# Altium project MAIN_BOARD.PrjPcb (part 1 of 2)
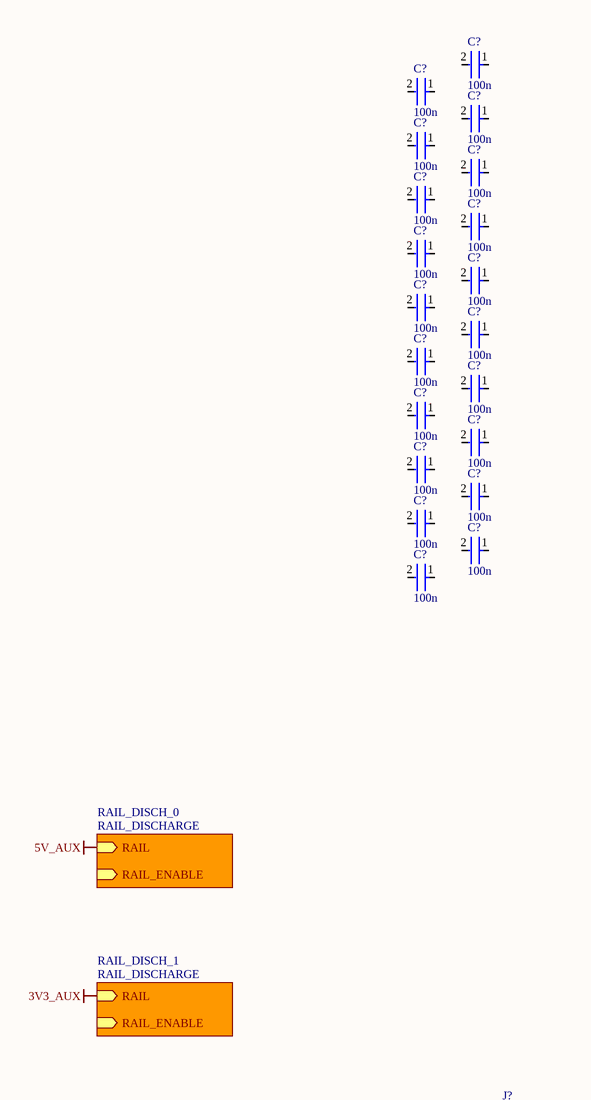
[diagram p0: MAIN_BOARD.SchDoc, top left]
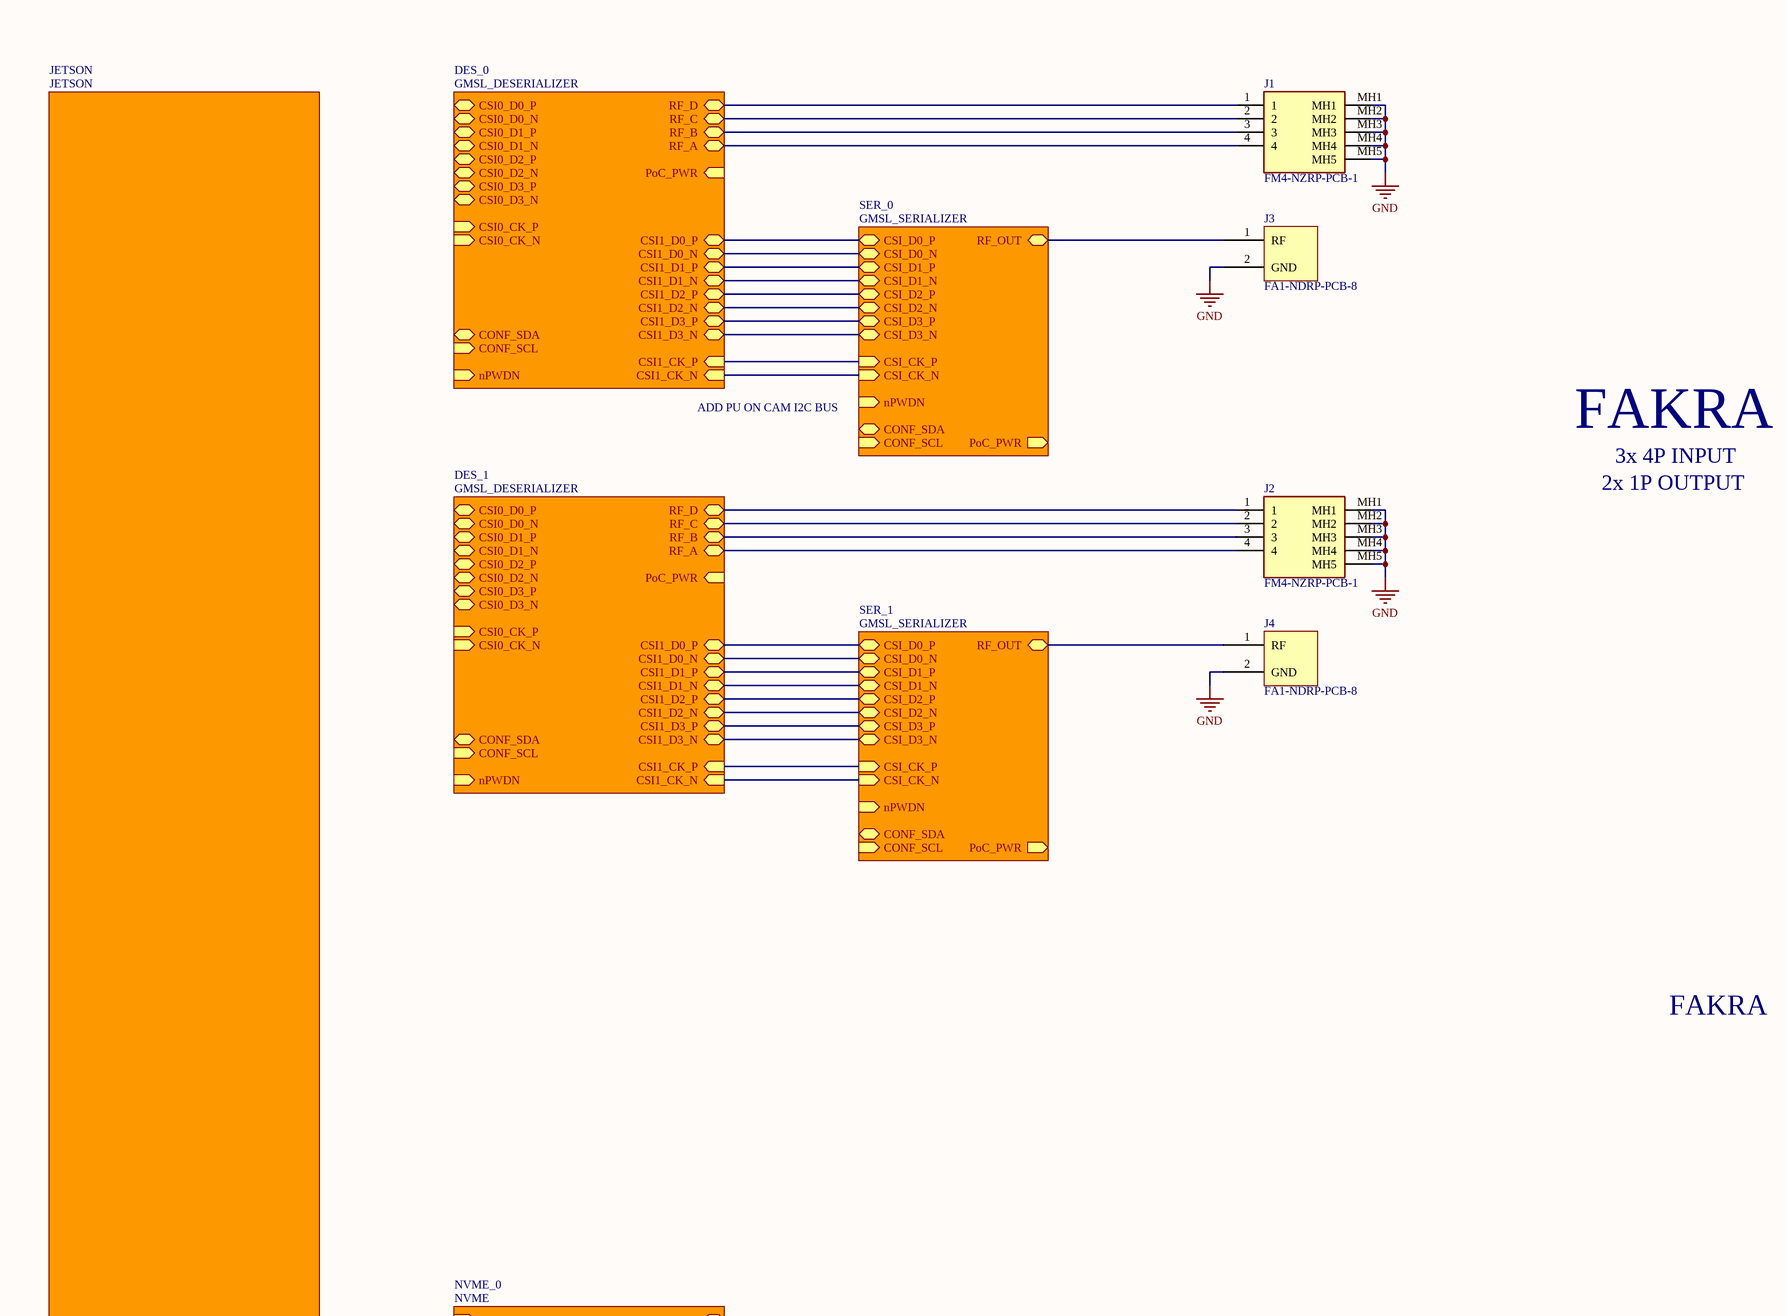
[diagram p1: MAIN_BOARD.SchDoc, top right]
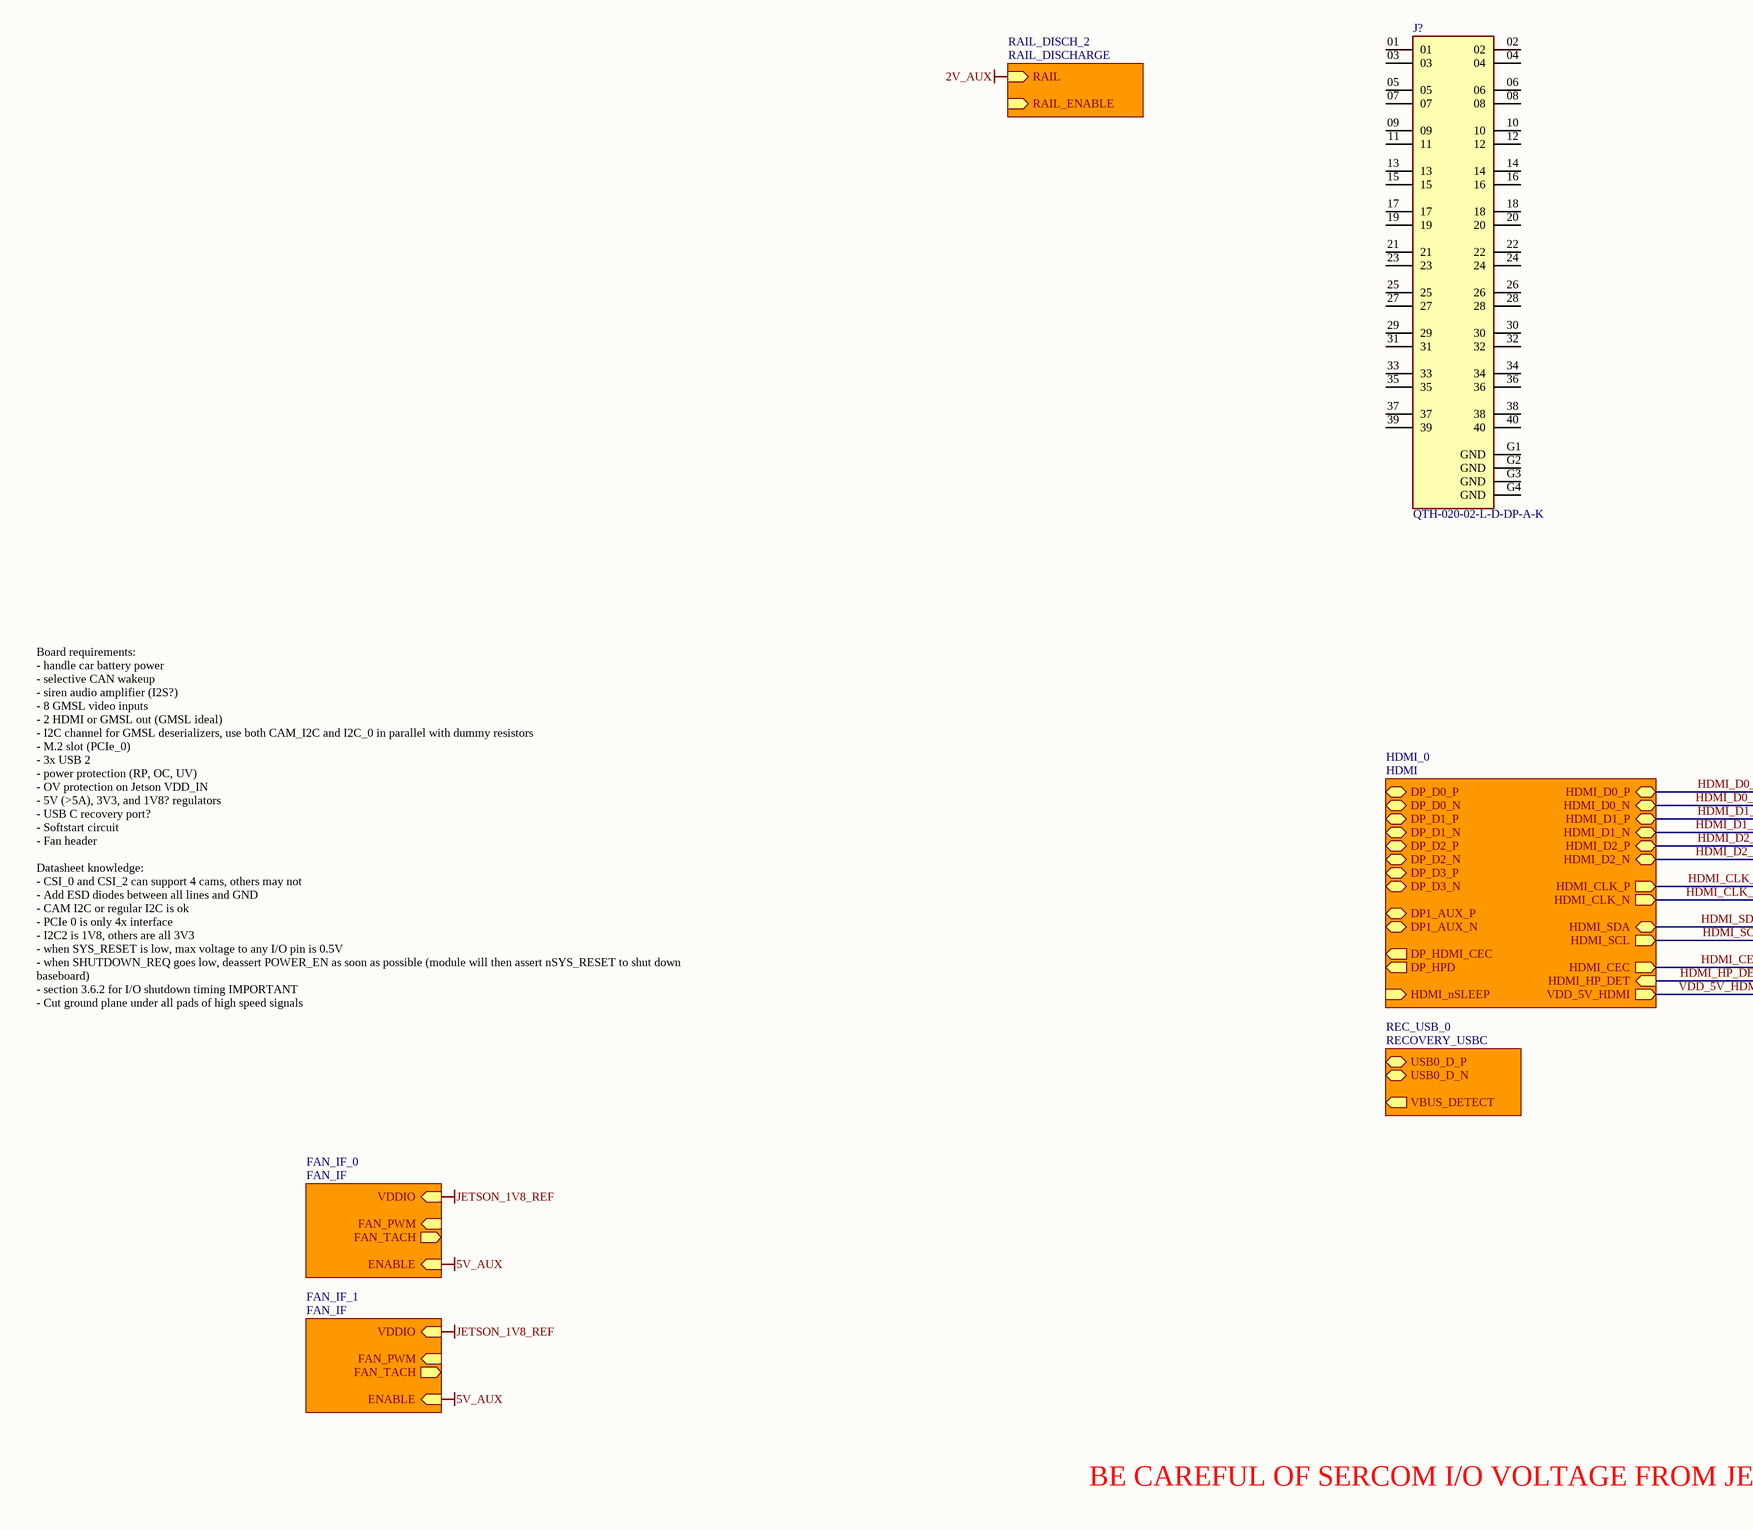
[diagram p2: MAIN_BOARD.SchDoc, bottom left]
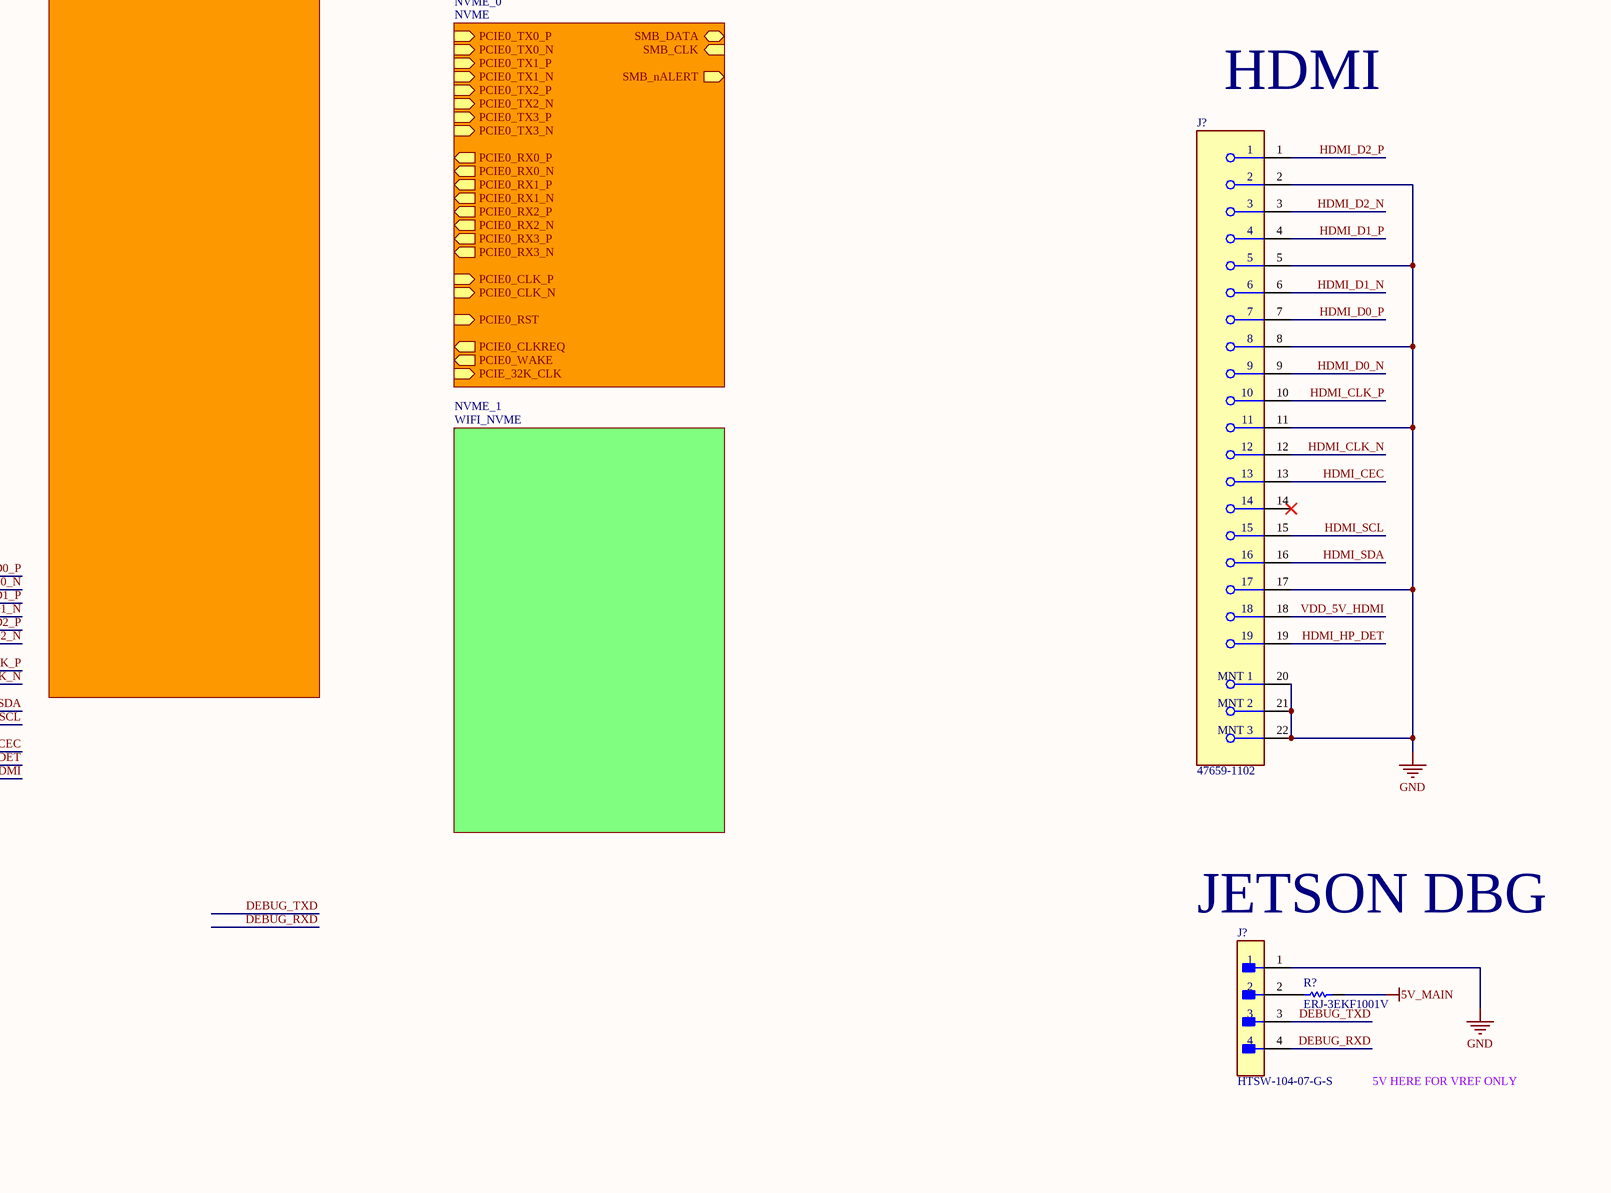
[diagram p3: MAIN_BOARD.SchDoc, bottom right]
5 sheets, 304 parts. Net scope: hierarchical (ports join the sheet entries above them; power ports are global).
Board file: ADAS_ECU_MB_revA.PcbDoc
Sheets:
  MAIN_BOARD.SchDoc
    NVME_0 = NVME.SchDoc
    HDMI_0 = HDMI.SchDoc
    REC_USB_0 = RECOVERY_USBC.SchDoc
    DES_1 = GMSL_DESERIALIZER.SchDoc
    DES_0 = GMSL_DESERIALIZER.SchDoc

## Sheet MAIN_BOARD.SchDoc
size D; SheetNumber: 1; SheetTotal: 11

### Parts
(Parts that share a designator on the sheet are numbered #1, #2 ... from top to bottom, then left to right.)
C?#1  100n  [FP-0402-L_1_0_0_05-W_0_5-IPC_A]
C?#2  100n  [FP-0402-L_1_0_0_05-W_0_5-IPC_A]
C?#3  100n  [FP-0402-L_1_0_0_05-W_0_5-IPC_A]
C?#4  100n  [FP-0402-L_1_0_0_05-W_0_5-IPC_A]
C?#5  100n  [FP-0402-L_1_0_0_05-W_0_5-IPC_A]
C?#6  100n  [FP-0402-L_1_0_0_05-W_0_5-IPC_A]
C?#7  100n  [FP-0402-L_1_0_0_05-W_0_5-IPC_A]
C?#8  100n  [FP-0402-L_1_0_0_05-W_0_5-IPC_A]
C?#9  100n  [FP-0402-L_1_0_0_05-W_0_5-IPC_A]
C?#10  100n  [FP-0402-L_1_0_0_05-W_0_5-IPC_A]
C?#11  100n  [FP-0402-L_1_0_0_05-W_0_5-IPC_A]
C?#12  100n  [FP-0402-L_1_0_0_05-W_0_5-IPC_A]
C?#13  100n  [FP-0402-L_1_0_0_05-W_0_5-IPC_A]
C?#14  100n  [FP-0402-L_1_0_0_05-W_0_5-IPC_A]
C?#15  100n  [FP-0402-L_1_0_0_05-W_0_5-IPC_A]
C?#16  100n  [FP-0402-L_1_0_0_05-W_0_5-IPC_A]
C?#17  100n  [FP-0402-L_1_0_0_05-W_0_5-IPC_A]
C?#18  100n  [FP-0402-L_1_0_0_05-W_0_5-IPC_A]
C?#19  100n  [FP-0402-L_1_0_0_05-W_0_5-IPC_A]
C?#20  100n  [FP-0402-L_1_0_0_05-W_0_5-IPC_A]
J1  FM4-NZRP-PCB-1  [FM4-NZRP-PCB-1-Footprint-1]
J2  FM4-NZRP-PCB-1  [FM4-NZRP-PCB-1-Footprint-1]
J3  FA1-NDRP-PCB-8  [FA1-NDRP-PCB-8-Footprint-1]
J4  FA1-NDRP-PCB-8  [FA1-NDRP-PCB-8-Footprint-1]
J?#1  QTH-020-02-L-D-DP-A-K  [QTH-020-02-L-D-DP-A-K-Footprint-1]
J?#2  47659-1102  [FP-47659-1102-MFG]
J?#3  HTSW-104-07-G-S  [FP-HTSW-104-07-G-S-MFG]
R?#1  ERJ-3EKF1001V  [RESC1608X55X30LL15T15]

### Sub-sheets
DES_0 = GMSL_DESERIALIZER: CSI0_D0_P (bidir), CSI0_D0_N (bidir), CSI0_D1_P (bidir), CSI0_D1_N (bidir), CSI0_D2_P (bidir), CSI0_D2_N (bidir), CSI0_D3_P (bidir), CSI0_D3_N (bidir), CSI0_CK_P (in), CSI0_CK_N (in), PoC_PWR (in), RF_B (bidir), RF_A (bidir), RF_C (bidir), RF_D (bidir), CSI1_D0_P (bidir), CSI1_D0_N (bidir), CSI1_D1_P (bidir), CSI1_D1_N (bidir), CSI1_D2_P (bidir), CSI1_D2_N (bidir), CSI1_D3_P (bidir), CSI1_D3_N (bidir), CSI1_CK_P (in), CSI1_CK_N (in), nPWDN (in), CONF_SDA (bidir), CONF_SCL (in)
DES_1 = GMSL_DESERIALIZER: CSI0_D0_P (bidir), CSI0_D0_N (bidir), CSI0_D1_P (bidir), CSI0_D1_N (bidir), CSI0_D2_P (bidir), CSI0_D2_N (bidir), CSI0_D3_P (bidir), CSI0_D3_N (bidir), CSI0_CK_P (in), CSI0_CK_N (in), PoC_PWR (in), RF_B (bidir), RF_A (bidir), RF_C (bidir), RF_D (bidir), CSI1_D0_P (bidir), CSI1_D0_N (bidir), CSI1_D1_P (bidir), CSI1_D1_N (bidir), CSI1_D2_P (bidir), CSI1_D2_N (bidir), CSI1_D3_P (bidir), CSI1_D3_N (bidir), CSI1_CK_P (in), CSI1_CK_N (in), nPWDN (in), CONF_SDA (bidir), CONF_SCL (in)
FAN_IF_0 = FAN_IF (file not in this document): FAN_PWM (in), FAN_TACH (out), VDDIO (in), ENABLE (in)
FAN_IF_1 = FAN_IF (file not in this document): FAN_PWM (in), FAN_TACH (out), VDDIO (in), ENABLE (in)
HDMI_0 = HDMI: DP_D0_P (bidir), DP_D0_N (bidir), DP_D1_P (bidir), DP_D1_N (bidir), DP_D2_P (bidir), DP_D2_N (bidir), DP_D3_P (bidir), DP_D3_N (bidir), DP1_AUX_P (bidir), DP1_AUX_N (bidir), DP_HDMI_CEC (out), DP_HPD (out), HDMI_nSLEEP (in), HDMI_D0_P (bidir), HDMI_D0_N (bidir), HDMI_D1_P (bidir), HDMI_D1_N (bidir), HDMI_D2_P (bidir), HDMI_D2_N (bidir), HDMI_CLK_P (out), HDMI_CLK_N (out), HDMI_SDA (bidir), HDMI_SCL (out), HDMI_CEC (out), HDMI_HP_DET (in), VDD_5V_HDMI (out)
JETSON = JETSON (file not in this document): no entries
NVME_0 = NVME: PCIE0_TX3_N (in), PCIE0_TX3_P (in), PCIE0_TX2_N (in), PCIE0_TX2_P (in), PCIE0_TX1_N (in), PCIE0_TX1_P (in), PCIE0_TX0_N (in), PCIE0_TX0_P (in), PCIE0_RX3_N (out), PCIE0_RX3_P (out), PCIE0_RX2_N (out), PCIE0_RX2_P (out), PCIE0_RX1_N (out), PCIE0_RX1_P (out), PCIE0_RX0_N (out), PCIE0_RX0_P (out), PCIE0_CLK_N (in), PCIE0_CLK_P (in), PCIE0_RST (in), PCIE0_CLKREQ (out), PCIE0_WAKE (out), PCIE_32K_CLK (in), SMB_DATA (bidir), SMB_CLK (in), SMB_nALERT (out)
NVME_1 = WIFI_NVME (file not in this document): no entries
RAIL_DISCH_0 = RAIL_DISCHARGE (file not in this document): RAIL (in), RAIL_ENABLE (in)
RAIL_DISCH_1 = RAIL_DISCHARGE (file not in this document): RAIL (in), RAIL_ENABLE (in)
RAIL_DISCH_2 = RAIL_DISCHARGE (file not in this document): RAIL (in), RAIL_ENABLE (in)
REC_USB_0 = RECOVERY_USBC: USB0_D_N (bidir), USB0_D_P (bidir), VBUS_DETECT (out)
SER_0 = GMSL_SERIALIZER (file not in this document): CSI_D0_P (bidir), CSI_D0_N (bidir), CSI_D1_P (bidir), CSI_D1_N (bidir), CSI_D2_P (bidir), CSI_D2_N (bidir), CSI_D3_P (bidir), CSI_D3_N (bidir), CSI_CK_P (in), CSI_CK_N (in), nPWDN (in), PoC_PWR (out), CONF_SDA (bidir), CONF_SCL (in), RF_OUT (bidir)
SER_1 = GMSL_SERIALIZER (file not in this document): CSI_D0_P (bidir), CSI_D0_N (bidir), CSI_D1_P (bidir), CSI_D1_N (bidir), CSI_D2_P (bidir), CSI_D2_N (bidir), CSI_D3_P (bidir), CSI_D3_N (bidir), CSI_CK_P (in), CSI_CK_N (in), nPWDN (in), PoC_PWR (out), CONF_SDA (bidir), CONF_SCL (in), RF_OUT (bidir)

### Nets
2V_AUX: sheet RAIL_DISCH_2/RAIL
5V_AUX: sheet FAN_IF_0/ENABLE, sheet FAN_IF_1/ENABLE, sheet RAIL_DISCH_0/RAIL
5V_MAIN: R?#1.1
GND: J1.MH1 J1.MH2 J1.MH3 J1.MH4 J1.MH5 J2.MH1 J2.MH2 J2.MH3 J2.MH4 J2.MH5 J3.2(GND) J4.2(GND) J?#2.2 J?#2.5 J?#2.8 J?#2.11 J?#2.17 J?#2.20(MNT_1) J?#2.21(MNT_2) J?#2.22(MNT_3) J?#3.1
JETSON_1V8_REF: sheet FAN_IF_0/VDDIO, sheet FAN_IF_1/VDDIO
CKB_N_DES_0: sheet SER_0/CSI_CK_N, sheet DES_0/CSI1_CK_N
CKB_N_DES_1: sheet SER_1/CSI_CK_N, sheet DES_1/CSI1_CK_N
CKB_P_DES_0: sheet SER_0/CSI_CK_P, sheet DES_0/CSI1_CK_P
CKB_P_DES_1: sheet SER_1/CSI_CK_P, sheet DES_1/CSI1_CK_P
DB0_N_DES_0: sheet SER_0/CSI_D0_N, sheet DES_0/CSI1_D0_N
DB0_N_DES_1: sheet SER_1/CSI_D0_N, sheet DES_1/CSI1_D0_N
DB0_P_DES_0: sheet SER_0/CSI_D0_P, sheet DES_0/CSI1_D0_P
DB0_P_DES_1: sheet SER_1/CSI_D0_P, sheet DES_1/CSI1_D0_P
DB1_N_DES_0: sheet SER_0/CSI_D1_N, sheet DES_0/CSI1_D1_N
DB1_N_DES_1: sheet SER_1/CSI_D1_N, sheet DES_1/CSI1_D1_N
DB1_P_DES_0: sheet SER_0/CSI_D1_P, sheet DES_0/CSI1_D1_P
DB1_P_DES_1: sheet SER_1/CSI_D1_P, sheet DES_1/CSI1_D1_P
DB2_N_DES_0: sheet SER_0/CSI_D2_N, sheet DES_0/CSI1_D2_N
DB2_N_DES_1: sheet SER_1/CSI_D2_N, sheet DES_1/CSI1_D2_N
DB2_P_DES_0: sheet SER_0/CSI_D2_P, sheet DES_0/CSI1_D2_P
DB2_P_DES_1: sheet SER_1/CSI_D2_P, sheet DES_1/CSI1_D2_P
DB3_N_DES_0: sheet SER_0/CSI_D3_N, sheet DES_0/CSI1_D3_N
DB3_N_DES_1: sheet SER_1/CSI_D3_N, sheet DES_1/CSI1_D3_N
DB3_P_DES_0: sheet SER_0/CSI_D3_P, sheet DES_0/CSI1_D3_P
DB3_P_DES_1: sheet SER_1/CSI_D3_P, sheet DES_1/CSI1_D3_P
DEBUG_RXD: J?#3.4
DEBUG_TXD: J?#3.3
HDMI_CEC: J?#2.13 ; sheet HDMI_0/HDMI_CEC
HDMI_CLK_N: J?#2.12 ; sheet HDMI_0/HDMI_CLK_N
HDMI_CLK_P: J?#2.10 ; sheet HDMI_0/HDMI_CLK_P
HDMI_D0_N: J?#2.9 ; sheet HDMI_0/HDMI_D0_N
HDMI_D0_P: J?#2.7 ; sheet HDMI_0/HDMI_D0_P
HDMI_D1_N: J?#2.6 ; sheet HDMI_0/HDMI_D1_N
HDMI_D1_P: J?#2.4 ; sheet HDMI_0/HDMI_D1_P
HDMI_D2_N: J?#2.3 ; sheet HDMI_0/HDMI_D2_N
HDMI_D2_P: J?#2.1 ; sheet HDMI_0/HDMI_D2_P
HDMI_HP_DET: J?#2.19 ; sheet HDMI_0/HDMI_HP_DET
HDMI_SCL: J?#2.15 ; sheet HDMI_0/HDMI_SCL
HDMI_SDA: J?#2.16 ; sheet HDMI_0/HDMI_SDA
PoC_A: J1.4 ; sheet DES_0/RF_A
PoC_A: J2.4 ; sheet DES_1/RF_A  [a separate net that carries the same name]
PoC_B: J1.3 ; sheet DES_0/RF_B
PoC_B: J2.3 ; sheet DES_1/RF_B  [a separate net that carries the same name]
PoC_C: J1.2 ; sheet DES_0/RF_C
PoC_C: J2.2 ; sheet DES_1/RF_C  [a separate net that carries the same name]
PoC_D: J1.1 ; sheet DES_0/RF_D
PoC_D: J2.1 ; sheet DES_1/RF_D  [a separate net that carries the same name]
VDD_5V_HDMI: J?#2.18 ; sheet HDMI_0/VDD_5V_HDMI
NetJ3_1: J3.1(RF) ; sheet SER_0/RF_OUT
NetJ4_1: J4.1(RF) ; sheet SER_1/RF_OUT
NetJ?#3_2: J?#3.2 R?#1.2

Not connected (* = marked no-connect by the designer): C?#1 1 2; C?#2 1 2; C?#3 1 2; C?#4 1 2; C?#5 1 2; C?#6 1 2; C?#7 1 2; C?#8 1 2; C?#9 1 2; C?#10 1 2; C?#11 1 2; C?#12 1 2; C?#13 1 2; C?#14 1 2; C?#15 1 2; C?#16 1 2; C?#17 1 2; C?#18 1 2; C?#19 1 2; C?#20 1 2; J?#1 01 02 03 04 05 06 07 08 09 10 11 12 13 14 15 16 17 18 19 20 21 22 23 24 25 26 27 28 29 30 31 32 33 34 35 36 37 38 39 40 G1(GND) G2(GND) G3(GND) G4(GND); J?#2 14*

### Notes on the sheet
- ADD PU ON CAM I2C BUS
- FAKRA
- 2x 1P OUTPUT
- 3x 4P INPUT
- HDMI
- Board requirements:
  - handle car battery power
  - selective CAN wakeup
  - siren audio amplifier (I2S?)
  - 8 GMSL video inputs
  - 2 HDMI or GMSL out (GMSL ideal)
  - I2C channel for GMSL deserializers, use both CAM_I2C and I2C_0 in parallel with dummy resistors
  - M.2 slot (PCIe_0)
  - 3x USB 2
  - power protection (RP, OC, UV)
  - OV protection on Jetson VDD_IN
  - 5V (>5A), 3V3, and 1V8? regulators
  - USB C recovery port?
  - Softstart circuit
  - Fan header
  Datasheet knowledge:
  - CSI_0 and CSI_2 can support 4 cams, others may not
  - Add ESD diodes between all lines and GND
  - CAM I2C or regular I2C is ok
  - PCIe 0 is only 4x interface
  - I2C2 is 1V8, others are all 3V3
  - when SYS_RESET is low, max voltage to any I/O pin is 0.5V
  - when SHUTDOWN_REQ goes low, deassert POWER_EN as soon as possible (module will then assert nSYS_RESET to shut down baseboard)
  - section 3.6.2 for I/O shutdown timing IMPORTANT
  - Cut ground plane under all pads of high speed signals
- (near J?#3) JETSON DBG
- 5V HERE FOR VREF ONLY
- BE CAREFUL OF SERCOM I/O VOLTAGE FROM JETSON

### Library data of the parts
C?#1-C?#20 = CMP-001-00058-1: LARGE PADS, 0402 CAP, CHANGE COMMENT TO MATCH REAL P/N; Capacitor Type: Ceramic; Min Operating Temperature: -55°C; Mounting Technology: Surface Mount; Pins: 2; Case/Package: 0402; RoHS Compliant: Yes; Max Operating Temperature: 85°C
J1 J2 = CMP-002-00044-4: Connector RF Mini-FAKRA Plug 9GHz 50Ohm Solder Right Angle Through Hole; Source: fakra4ch.SchLib; Component Type: Standard; Pins: 9; Design Item ID: CMP-002-00085-1
J3 J4 = CMP-002-00054-1: RF F Connector, Male, Board Mount, Solder Terminal, Plug; Connector Type: RF F CONNECTOR; RoHS Compliant: Yes; Mounting Technology: Board
J?#1 = CMP-002-00077-1: Board Stacking Connector; Connector Type: BOARD STACKING CONNECTOR; RoHS Compliant: Yes
J?#2 = CMP-04768-000010-1: HDMI REC.VERTICAL SMT TYPE W/HEI; RoHS Compliant: Yes
J?#3 = CMP-02766-001776-1: CONN HEADER VERT 4POS 2.54MM; Gender: Male; Number of Contacts: 4; Packaging: Bulk; RoHS Compliant: Yes; Number of Rows: 1; Mount: Through Hole; Contact Material: Bronze; Series: HTSW; Radiation Hardening: No; Pitch: 2.54mm; Reach SVHC Compliant: Yes; Contact Plating: Gold; Termination: Through Hole
R?#1 = CMP-2000-00180-1: Manufacturer: Panasonic; Part Number: ERJ-3EKF1001V

## Sheet NVME.SchDoc
size C; SheetNumber: 5; SheetTotal: 11
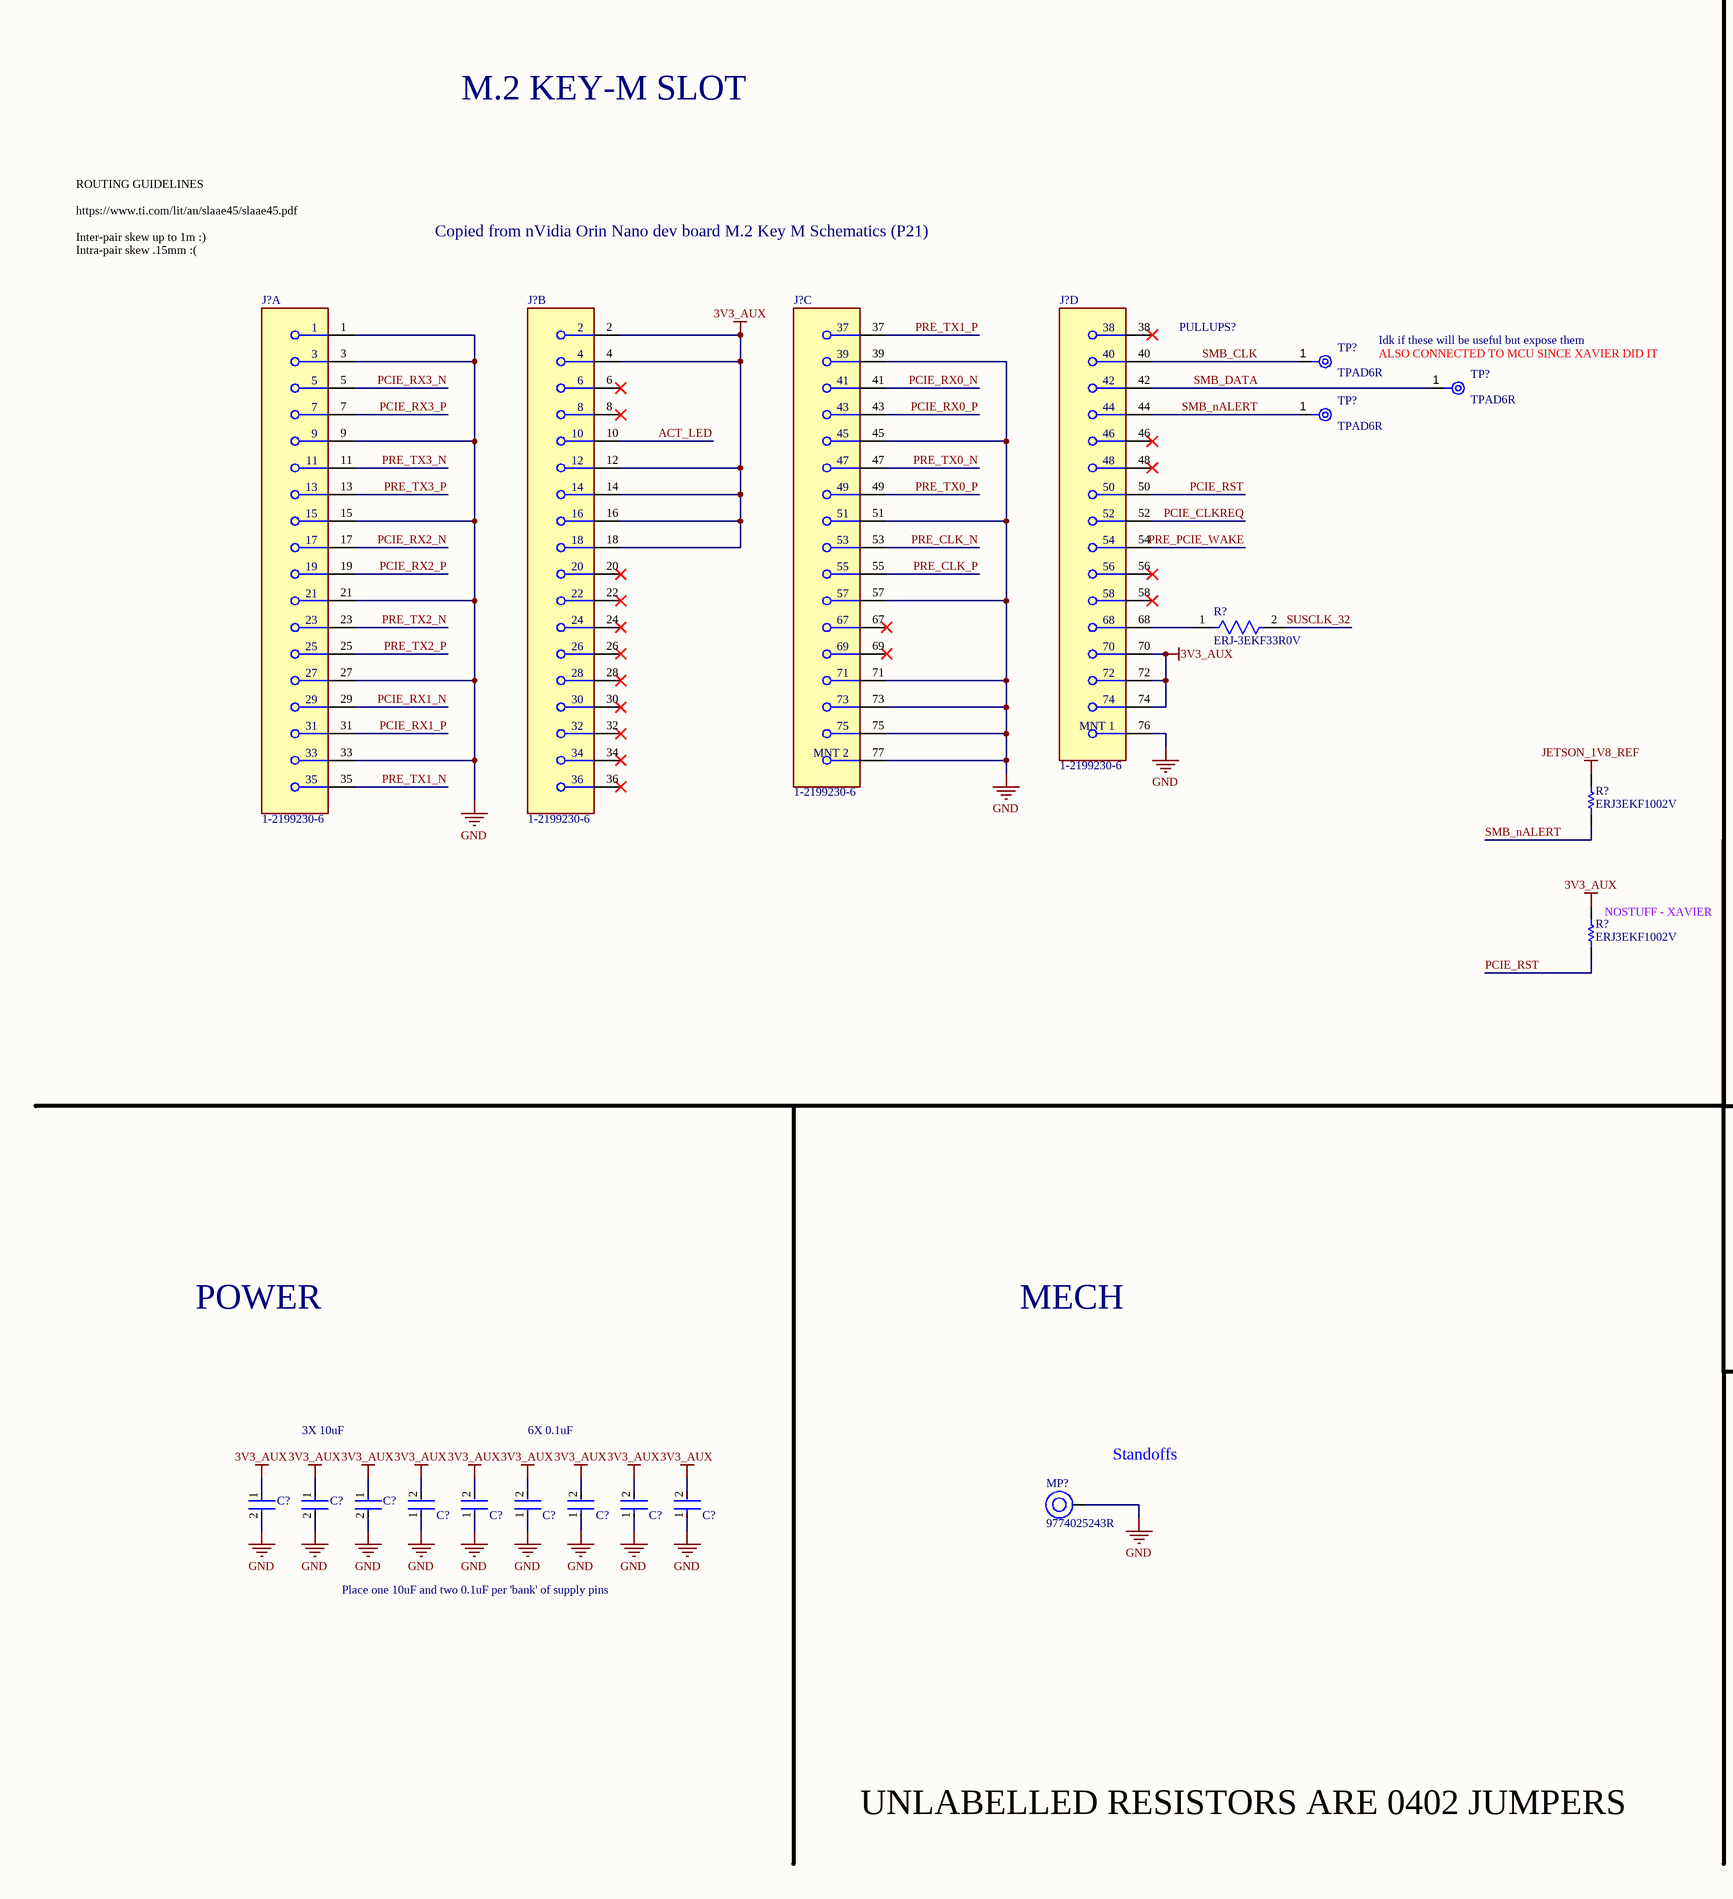
[diagram p4: NVME.SchDoc, left]
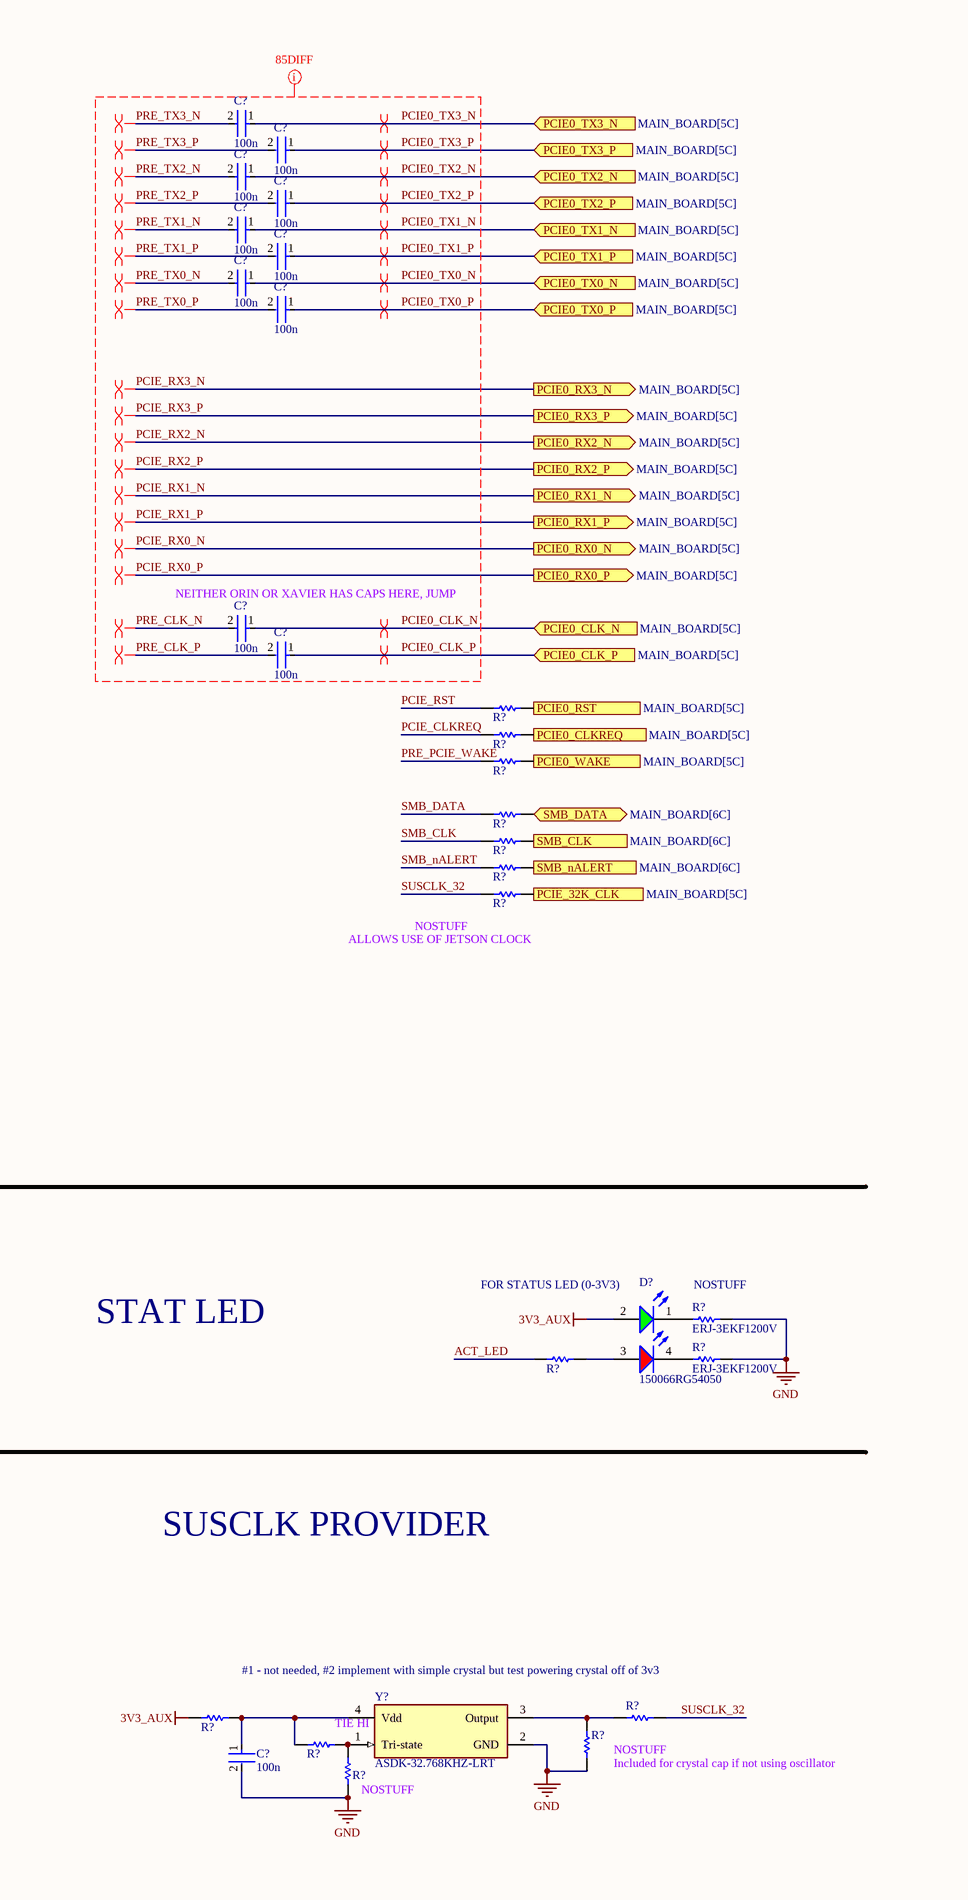
[diagram p5: NVME.SchDoc, right]

### Parts
(Parts that share a designator on the sheet are numbered #1, #2 ... from top to bottom, then left to right.)
C?#21  100n  [FP-0402-L_1_0_0_05-W_0_5-IPC_A]
C?#22  100n  [FP-0402-L_1_0_0_05-W_0_5-IPC_A]
C?#23  100n  [FP-0402-L_1_0_0_05-W_0_5-IPC_A]
C?#24  100n  [FP-0402-L_1_0_0_05-W_0_5-IPC_A]
C?#25  100n  [FP-0402-L_1_0_0_05-W_0_5-IPC_A]
C?#26  100n  [FP-0402-L_1_0_0_05-W_0_5-IPC_A]
C?#27  100n  [FP-0402-L_1_0_0_05-W_0_5-IPC_A]
C?#28  100n  [FP-0402-L_1_0_0_05-W_0_5-IPC_A]
C?#29  100n  [FP-0402-L_1_0_0_05-W_0_5-IPC_A]
C?#30  100n  [FP-0402-L_1_0_0_05-W_0_5-IPC_A]
C?#31  GRM188R60J106ME47D  [FP-GRM188-0_1-e0_2_0_55-IPC_A]  (value not drawn)
C?#32  GRM188R60J106ME47D  [FP-GRM188-0_1-e0_2_0_55-IPC_A]  (value not drawn)
C?#33  GRM188R60J106ME47D  [FP-GRM188-0_1-e0_2_0_55-IPC_A]  (value not drawn)
C?#34  C1005X7R1H104K050BB  [FP-C1005-050-0_05-IPC_C]  (value not drawn)
C?#35  C1005X7R1H104K050BB  [FP-C1005-050-0_05-IPC_C]  (value not drawn)
C?#36  C1005X7R1H104K050BB  [FP-C1005-050-0_05-IPC_C]  (value not drawn)
C?#37  C1005X7R1H104K050BB  [FP-C1005-050-0_05-IPC_C]  (value not drawn)
C?#38  C1005X7R1H104K050BB  [FP-C1005-050-0_05-IPC_C]  (value not drawn)
C?#39  C1005X7R1H104K050BB  [FP-C1005-050-0_05-IPC_C]  (value not drawn)
C?#40  100n  [FP-0402-L_1_0_0_05-W_0_5-IPC_A]
D?  150066RG54050  [WL-SBCD_0606]
J?#4  1-2199230-6  [FP-1-2199230-6-MFG]  (part A of 4)
J?#5  1-2199230-6  [FP-1-2199230-6-MFG]  (part B of 4)
J?#6  1-2199230-6  [FP-1-2199230-6-MFG]  (part C of 4)
J?#7  1-2199230-6  [FP-1-2199230-6-MFG]  (part D of 4)
MP?  9774025243R  [9774025243]
R?#2  0402 JUMPER  [RESC1005X40X25ML05T05]  (value not drawn)
R?#3  ERJ-3EKF33R0V  [FP-ERJ3EK-MFG]
R?#4  0402 JUMPER  [RESC1005X40X25ML05T05]  (value not drawn)
R?#5  0402 JUMPER  [RESC1005X40X25ML05T05]  (value not drawn)
R?#6  0402 JUMPER  [RESC1005X40X25ML05T05]  (value not drawn)
R?#7  0402 JUMPER  [RESC1005X40X25ML05T05]  (value not drawn)
R?#8  0402 JUMPER  [RESC1005X40X25ML05T05]  (value not drawn)
R?#9  0402 JUMPER  [RESC1005X40X25ML05T05]  (value not drawn)
R?#10  ERJ3EKF1002V  [RESC1609X55X30LL15T15]
R?#11  ERJ3EKF1002V  [RESC1609X55X30LL15T15]
R?#12  ERJ-3EKF1200V  [RESC1609X55X30ML15T15]
R?#13  0402 JUMPER  [RESC1005X40X25ML05T05]  (value not drawn)
R?#14  ERJ-3EKF1200V  [RESC1609X55X30ML15T15]
R?#15  0402 JUMPER  [RESC1005X40X25ML05T05]  (value not drawn)
R?#16  0402 JUMPER  [RESC1005X40X25ML05T05]  (value not drawn)
R?#17  0402 JUMPER  [RESC1005X40X25ML05T05]  (value not drawn)
R?#18  0402 JUMPER  [RESC1005X40X25ML05T05]  (value not drawn)
R?#19  0402 JUMPER  [RESC1005X40X25ML05T05]  (value not drawn)
TP?#1  TPAD6R  [New footprint 1]
TP?#2  TPAD6R  [New footprint 1]
TP?#3  TPAD6R  [New footprint 1]
Y?  ASDK-32.768KHZ-LRT  [FP-ASDK-MFG]

### Ports
PCIE0_CLK_N (in, see MAIN_BOARD[5C]), PCIE0_CLK_P (in, see MAIN_BOARD[5C]), PCIE0_CLKREQ (out, see MAIN_BOARD[5C]), PCIE0_RST (in, see MAIN_BOARD[5C]), PCIE0_RX0_N (out, see MAIN_BOARD[5C]), PCIE0_RX0_P (out, see MAIN_BOARD[5C]), PCIE0_RX1_N (out, see MAIN_BOARD[5C]), PCIE0_RX1_P (out, see MAIN_BOARD[5C]), PCIE0_RX2_N (out, see MAIN_BOARD[5C]), PCIE0_RX2_P (out, see MAIN_BOARD[5C]), PCIE0_RX3_N (out, see MAIN_BOARD[5C]), PCIE0_RX3_P (out, see MAIN_BOARD[5C]), PCIE0_TX0_N (in, see MAIN_BOARD[5C]), PCIE0_TX0_P (in, see MAIN_BOARD[5C]), PCIE0_TX1_N (in, see MAIN_BOARD[5C]), PCIE0_TX1_P (in, see MAIN_BOARD[5C]), PCIE0_TX2_N (in, see MAIN_BOARD[5C]), PCIE0_TX2_P (in, see MAIN_BOARD[5C]), PCIE0_TX3_N (in, see MAIN_BOARD[5C]), PCIE0_TX3_P (in, see MAIN_BOARD[5C]), PCIE0_WAKE (out, see MAIN_BOARD[5C]), PCIE_32K_CLK (in, see MAIN_BOARD[5C]), SMB_CLK (in, see MAIN_BOARD[6C]), SMB_DATA (bidir, see MAIN_BOARD[6C]), SMB_nALERT (out, see MAIN_BOARD[6C])

### Nets
3V3_AUX: C?#31.1 C?#32.1 C?#33.1 C?#34.2 C?#35.2 C?#36.2 C?#37.2 C?#38.2 C?#39.2 D?.2(A) J?#5.2 J?#5.4 J?#5.12 J?#5.14 J?#5.16 J?#5.18 J?#7.70 J?#7.72 J?#7.74 R?#11.2 R?#15.1
GND: C?#31.2 C?#32.2 C?#33.2 C?#34.1 C?#35.1 C?#36.1 C?#37.1 C?#38.1 C?#39.1 C?#40.2 J?#4.1 J?#4.3 J?#4.9 J?#4.15 J?#4.21 J?#4.27 J?#4.33 J?#6.39 J?#6.45 J?#6.51 J?#6.57 J?#6.71 J?#6.73 J?#6.75 J?#6.77(MNT_2) J?#7.76(MNT_1) MP?.1 R?#12.1 R?#14.1 R?#18.1 R?#19.1 Y?.2(GND)
JETSON_1V8_REF: R?#10.2
ACT_LED: J?#5.10 R?#13.1
PCIE0_CLK_N: C?#29.1 ; port PCIE0_CLK_N
PCIE0_CLK_P: C?#30.1 ; port PCIE0_CLK_P
PCIE0_TX0_N: C?#27.1 ; port PCIE0_TX0_N
PCIE0_TX0_P: C?#28.1 ; port PCIE0_TX0_P
PCIE0_TX1_N: C?#25.1 ; port PCIE0_TX1_N
PCIE0_TX1_P: C?#26.1 ; port PCIE0_TX1_P
PCIE0_TX2_N: C?#23.1 ; port PCIE0_TX2_N
PCIE0_TX2_P: C?#24.1 ; port PCIE0_TX2_P
PCIE0_TX3_N: C?#21.1 ; port PCIE0_TX3_N
PCIE0_TX3_P: C?#22.1 ; port PCIE0_TX3_P
PCIE_CLKREQ: J?#7.52 R?#4.1
PCIE_RST: J?#7.50 R?#2.1 R?#11.1
PCIE_RX0_N: J?#6.41 ; port PCIE0_RX0_N
PCIE_RX0_P: J?#6.43 ; port PCIE0_RX0_P
PCIE_RX1_N: J?#4.29 ; port PCIE0_RX1_N
PCIE_RX1_P: J?#4.31 ; port PCIE0_RX1_P
PCIE_RX2_N: J?#4.17 ; port PCIE0_RX2_N
PCIE_RX2_P: J?#4.19 ; port PCIE0_RX2_P
PCIE_RX3_N: J?#4.5 ; port PCIE0_RX3_N
PCIE_RX3_P: J?#4.7 ; port PCIE0_RX3_P
PRE_CLK_N: C?#29.2 J?#6.53
PRE_CLK_P: C?#30.2 J?#6.55
PRE_PCIE_WAKE: J?#7.54 R?#5.1
PRE_TX0_N: C?#27.2 J?#6.47
PRE_TX0_P: C?#28.2 J?#6.49
PRE_TX1_N: C?#25.2 J?#4.35
PRE_TX1_P: C?#26.2 J?#6.37
PRE_TX2_N: C?#23.2 J?#4.23
PRE_TX2_P: C?#24.2 J?#4.25
PRE_TX3_N: C?#21.2 J?#4.11
PRE_TX3_P: C?#22.2 J?#4.13
SMB_CLK: J?#7.40 R?#7.1 TP?#1.1(TP)
SMB_DATA: J?#7.42 R?#6.1 TP?#2.1(TP)
SMB_nALERT: J?#7.44 R?#8.1 R?#10.1 TP?#3.1(TP)
SUSCLK_32: R?#3.2 R?#9.1 R?#17.1
NetC?#40_1: C?#40.1 R?#15.2 R?#16.1 Y?.4(Vdd)
NetD?_1: D?.1(K) R?#12.2
NetD?_3: D?.3(A) R?#13.2
NetD?_4: D?.4(K) R?#14.2
NetJ?#7_68: J?#7.68 R?#3.1
NetR?#2_2: R?#2.2 ; port PCIE0_RST
NetR?#4_2: R?#4.2 ; port PCIE0_CLKREQ
NetR?#5_2: R?#5.2 ; port PCIE0_WAKE
NetR?#6_2: R?#6.2 ; port SMB_DATA
NetR?#7_2: R?#7.2 ; port SMB_CLK
NetR?#8_2: R?#8.2 ; port SMB_nALERT
NetR?#9_2: R?#9.2 ; port PCIE_32K_CLK
NetR?#16_2: R?#16.2 R?#19.2 Y?.1(Tri-state)
NetR?#17_2: R?#17.2 R?#18.2 Y?.3(Output)

Not connected (* = marked no-connect by the designer): J?#5 6* 8* 20* 22* 24* 26* 28* 30* 32* 34* 36*; J?#6 67* 69*; J?#7 38* 46* 48* 56* 58*

### Layout directives
differential pair; differential pair class 85DIFF: PCIE0_CLK_N, PCIE0_CLK_P, PCIE0_TX0_N, PCIE0_TX0_P, PCIE0_TX1_N, PCIE0_TX1_P, PCIE0_TX2_N, PCIE0_TX2_P, PCIE0_TX3_N, PCIE0_TX3_P, PCIE_RX0_N, PCIE_RX0_P, PCIE_RX1_N, PCIE_RX1_P, PCIE_RX2_N, PCIE_RX2_P, PCIE_RX3_N, PCIE_RX3_P, PRE_CLK_N, PRE_CLK_P, PRE_TX0_N, PRE_TX0_P, PRE_TX1_N, PRE_TX1_P, PRE_TX2_N, PRE_TX2_P, PRE_TX3_N, PRE_TX3_P
net class 85DIFF: PCIE0_CLK_N, PCIE0_CLK_P, PCIE0_TX0_N, PCIE0_TX0_P, PCIE0_TX1_N, PCIE0_TX1_P, PCIE0_TX2_N, PCIE0_TX2_P, PCIE0_TX3_N, PCIE0_TX3_P, PCIE_RX0_N, PCIE_RX0_P, PCIE_RX1_N, PCIE_RX1_P, PCIE_RX2_N, PCIE_RX2_P, PCIE_RX3_N, PCIE_RX3_P, PRE_CLK_N, PRE_CLK_P, PRE_TX0_N, PRE_TX0_P, PRE_TX1_N, PRE_TX1_P, PRE_TX2_N, PRE_TX2_P, PRE_TX3_N, PRE_TX3_P

### Notes on the sheet
- M.2 KEY-M SLOT
- ROUTING GUIDELINES
  https://www.ti.com/lit/an/slaae45/slaae45.pdf
  Inter-pair skew up to 1m :)
  Intra-pair skew .15mm :(
- Copied from nVidia Orin Nano dev board M.2 Key M Schematics (P21)
- PULLUPS?
- (near TP?#2) Idk if these will be useful but expose them
- (near TP?#2) ALSO CONNECTED TO MCU SINCE XAVIER DID IT
- (near C?#29) NEITHER ORIN OR XAVIER HAS CAPS HERE, JUMP
- (near R?#9) ALLOWS USE OF JETSON CLOCK
- (near R?#9) NOSTUFF
- (near R?#11) NOSTUFF - XAVIER
- STAT LED
- (near D?) FOR STATUS LED (0-3V3)
- (near R?#12) NOSTUFF
- POWER
- MECH
- 3X 10uF
- 6X 0.1uF
- Standoffs
- SUSCLK PROVIDER
- Place one 10uF and two 0.1uF per 'bank' of supply pins
- #1 - not needed, #2 implement with simple crystal but test powering crystal off of 3v3
- (near Y?) TIE HI
- (near R?#19) NOSTUFF
- (near R?#18) NOSTUFF
- (near R?#18) Included for crystal cap if not using oscillator
- UNLABELLED RESISTORS ARE 0402 JUMPERS

### Library data of the parts
C?#21-C?#30 C?#40 = CMP-001-00058-1: as C?#1 on sheet MAIN_BOARD; Min Operating Temperature: -55°C; Mounting Technology: Surface Mount; Pins: 2; Case/Package: 0402; RoHS Compliant: Yes; Max Operating Temperature: 85°C
C?#31-C?#33 = CMP-2006-02792-2: Chip Multilayer Ceramic Capacitors for General Purpose, 0603, 10uF, X5R, 15%, 20%, 6.3V; Packaging: Tape and Reel; Voltage Rating (DC): 6.3V; Width: 0.031inch; Termination: SMD/SMT; Dielectric: X5R; Package Quantity: 4000; Voltage Rating: 6.3V; Capacitance: 10uF; Case/Package: 0603; Min Operating Temperature: -55°C; Voltage: 6.3V; Length: 1.6mm; Thickness: 0.035inch; Lead Free: Lead Free; Depth: 0.8mm; Case Code (Imperial): 0603; Max Operating Temperature: 85°C; Material: Ceramic; Height: 0.8mm; Tolerance: 20%; Mount: Surface Mount; REACH SVHC: No SVHC; Radiation Hardening: No; Case Code (Metric): 1608
C?#34-C?#39 = CMP-2000-05393-2: Multilayer Ceramic Capacitors 100nF ±10% 50V X7R SMD 0402; Voltage: 50V; Dielectric Material: Ceramic; Min Operating Temperature: -55°C; Depth: 0.5mm; Radiation Hardening: No; RoHS Compliant: Yes; Voltage Rating (DC): 50V; Lead Free: Lead Free; Resistor Type: Ceramic; Height: 0.5mm; Dielectric: X7R; Thickness: 0.022inch; Case/Package: 0402; Case Code (Metric): 1005; Termination: SMD/SMT; Capacitance: 100nF; Packaging: Tape and Reel; Max Operating Temperature: 125°C; Mount: Surface Mount; Package Quantity: 1; Width: 0.02inch; Weight: 2.3E-05oz; Voltage Rating: 50V; Tolerance: 10%; Construction: Flat; Case Code (Imperial): 0402; Length: 1mm; REACH SVHC: No SVHC; Series: C
D? = CMP-004-00040-2: Led, Red/Grn, 180Mcd/230Mcd, 624Nm/525Nm Rohs Compliant: Yes; Source: rgled.SchLib; Component Type: Standard; Pins: 4; Design Item ID: CMP-004-00034-2
J?#4-J?#7 = CMP-03365-000001-1: CONN EDGE DUAL FMALE 67POS 0.020; Manufacturer: TE; Number Of Contacts: 67; Current Rating: 0.5A; Pitch: 0.5mm; Conn Gender: Female; Is Female: yes; Voltage Rating: 50V; Conn Orientation: Right Angle; Automotive: No; Temperature Range High: +80°C; Package: 1-2199230-6; Category: Conn; Temperature: -40°C to +80°C; Number Of Rows: 2; ComponentLink2URL: http://www.te.com/commerce/DocumentDelivery/DDEController?Action=showdoc&DocId=Specification+Or+Standard%7F114-115006%7FB%7Fpdf%7FEnglish%7FENG_SS_114-115006_B_114-115006_REV_B.pdf%7F1-2199230-6; Manufacturer Part Number: 1-2199230-6; Height: 4.2mm; RoHS: TRUE; Footprint Url: http://www.te.com/commerce/DocumentDelivery/DDEController?Action=showdoc&DocId=Customer+Drawing%7F2199230%7FB2%7Fpdf%7FEnglish%7FENG_CD_2199230_B2.pdf%7F1-2199230-6; Digikey Description: CONN EDGE DUAL FMALE 67POS 0.020; Device Class L2: Card Edge Connectors; Contact Material: Gold,Tin; Device Class L1: Connectors; Device Class L3: unset; ComponentLink2Description: Datasheet; Temperature Range Low: -40°C; Octopart: https://octopart.com/1-2199230-6-te+connectivity-34969376; Lead Free: Yes
MP? = CMP-03913-59774857-1: 9774025243R Spacer Material: Steel, Tin-Plated Mounting: SMT Series: WA-SMST Thread D: M2; Outside Diameter: 4.3434mm; Threaded/Unthreaded: Threaded; Plating: Tin; REACH SVHC: Unknown; NexarPartId: 59774857; RoHS: Compliant; Material: Steel; Packaging: Tape and Reel; Max Operating Temperature: 150°C; Min Operating Temperature: -55°C; Length: 2.5mm; Height: 2.5mm
R?#2 R?#4-R?#9 R?#13 R?#15-R?#19 = CMP-009-00118-2: READ THE NAME; Pins: 2; Component Type: Standard; Design Item ID: CMP-009-00206-2; Source: 0402jump.SchLib
R?#3 = CMP-2000-00443-2: RES SMD 33 OHM 1% 1/10W 0603; Voltage Rating (DC): 75V; Power Rating: 100mW; Resistance: 33R; Temperature Coefficient: 100ppm/°C; Min Operating Temperature: -55°C; Packaging: Tape and Reel; Mount: Surface Mount; Lead Free: Lead Free; Voltage Rating: 75V; Features: Automotive AEC-Q200; Height: 0.022inch; Width: 0.031inch; Number of Pins: 2; Package Quantity: 1; Case Code (Metric): 1608; Max Power Dissipation: 100mW; Case Code (Imperial): 0603; Termination: SMD/SMT; Resistance Tolerance: 1%; Max Operating Temperature: 155°C; Tolerance: 1%; Length: 1.6mm; Case/Package: 0603; Military Standard: Not; RoHS Compliant: Yes; Series: ERJ; Size Code: 0603; Construction: Rectangular; Number of Terminations: 2; Radiation Hardening: No; Resistor Type: Thick Film; Contact Plating: Tin; Depth: 0.8mm; REACH SVHC: No SVHC
R?#10 R?#11 = CMP-1012-00623-3: Chip Resistor, 10 KOhm, +/- 1%, 0.1 W, -55 to 155 degC, 0603 (1608 Metric), RoHS, Tape and Reel; Manufacturer: Panasonic; Voltage Rating: 75V; Case\/Package: 0603; Power Rating: 100mW; Resistance: 10KOhm; Temperature Coefficient: 100ppm\/degreesC; Number of Pins: 2; Package Reference: 603; Depth: 0.8mm; Mount: SurfaceMount; Package Description: 2-Pin Surface Mount Device, Body 1.6 x 0.85 mm; Datasheet Version: 02/2017; Length: 1.6mm; Lead Free: LeadFree; Height: 0.45mm; Number of Terminations: 2; Max Power Dissipation: 100mW; Min Operating Temperature: -55degC; Datasheet URL: https://industrial.panasonic.com/cdbs/www-data/pdf/RDA0000/AOA0000C304.pdf; Termination: SMD/SMT; Case Code (Metric): 1608; Case Code (Imperial): 0603; Tolerance: 1%; Max Operating Temperature: 155degC; RoHSCompliant: true; Voltage Rating (DC): 75V; Radiation Hardening: No; Packaging: TapeandReel; Composition: ThickFilm; Mounting Technology: SurfaceMount; Manufacturer URL: http://www.panasonic.com/; Width: 0.031inch; REACH SVHC: NoSVHC; Contact Plating: Tin; Military Standard: Not; Package Quantity: 1
R?#12 R?#14 = CMP-2000-00213-2: Chip Resistor, 120 Ohm, +/- 1%, 0.1 W, -55 to 155 degC, 0603 (1608 Metric), RoHS, Tape and Reel; Manufacturer: Panasonic; Power Rating: 100mW; Voltage Rating (DC): 75V; Resistance: 120Ohm; Temperature Coefficient: 100ppm/degreesC; Number of Terminations: 2; Military Standard: Not; Tolerance: 1%; Min Operating Temperature: -55degC; Packaging: TapeandReel; Lead Free: LeadFree; Max Operating Temperature: 155degC; Manufacturer URL: http://www.panasonic.com/; Case Code (Imperial): 0603; REACH SVHC: NoSVHC; Width: 0.031inch; Datasheet URL: https://industrial.panasonic.com/cdbs/www-data/pdf/RDA0000/AOA0000C283.pdf; RoHSCompliant: true; Max Power Dissipation: 100mW; Termination: SMD/SMT; Package Reference: 0603; Height: 0.022inch; Depth: 0.8mm; Package Description: 2-Pin Surface Mount Device, Body 1.6 x 0.85 mm; Contact Plating: Tin; Length: 1.6mm; Package URL: http://www.st.com/st-web-ui/static/active/en/resource/technical/document/datasheet/CD00001320.pdf; Radiation Hardening: No; Package Quantity: 1; Number of Pins: 2; Datasheet Version: 42095.0; Voltage Rating: 75V; Composition: ThickFilm; Case/Package: 0603; Mount: SurfaceMount; Case Code (Metric): 1608
TP?#1-TP?#3 = CMP-00025-2: Test Point .6mm
Y? = CMP-27762-001115-1: XTAL OSC XO 32.7680KHZ CMOS SMD; Load Capacitance: 15pF; Max Supply Current: 3.5mA; Min Supply Voltage: 2.97V; Operating Supply Voltage: 3.3V; Frequency Stability: 25ppm; Lead Free: Lead Free; Case/Package: CSMD; Number of Pins: 4; Max Operating Temperature: 85°C; Packaging: Tape and Reel; Width: 0.079inch; Min Operating Temperature: -40°C; Radiation Hardening: No; Length: 2.5mm; Depth: 2mm; Termination: SMD/SMT; Height: 0.037inch; Series: ASDK; Frequency: 32.768kHz; Mount: Surface Mount

## Sheet HDMI.SchDoc
size A2; SheetNumber: 4; SheetTotal: 11
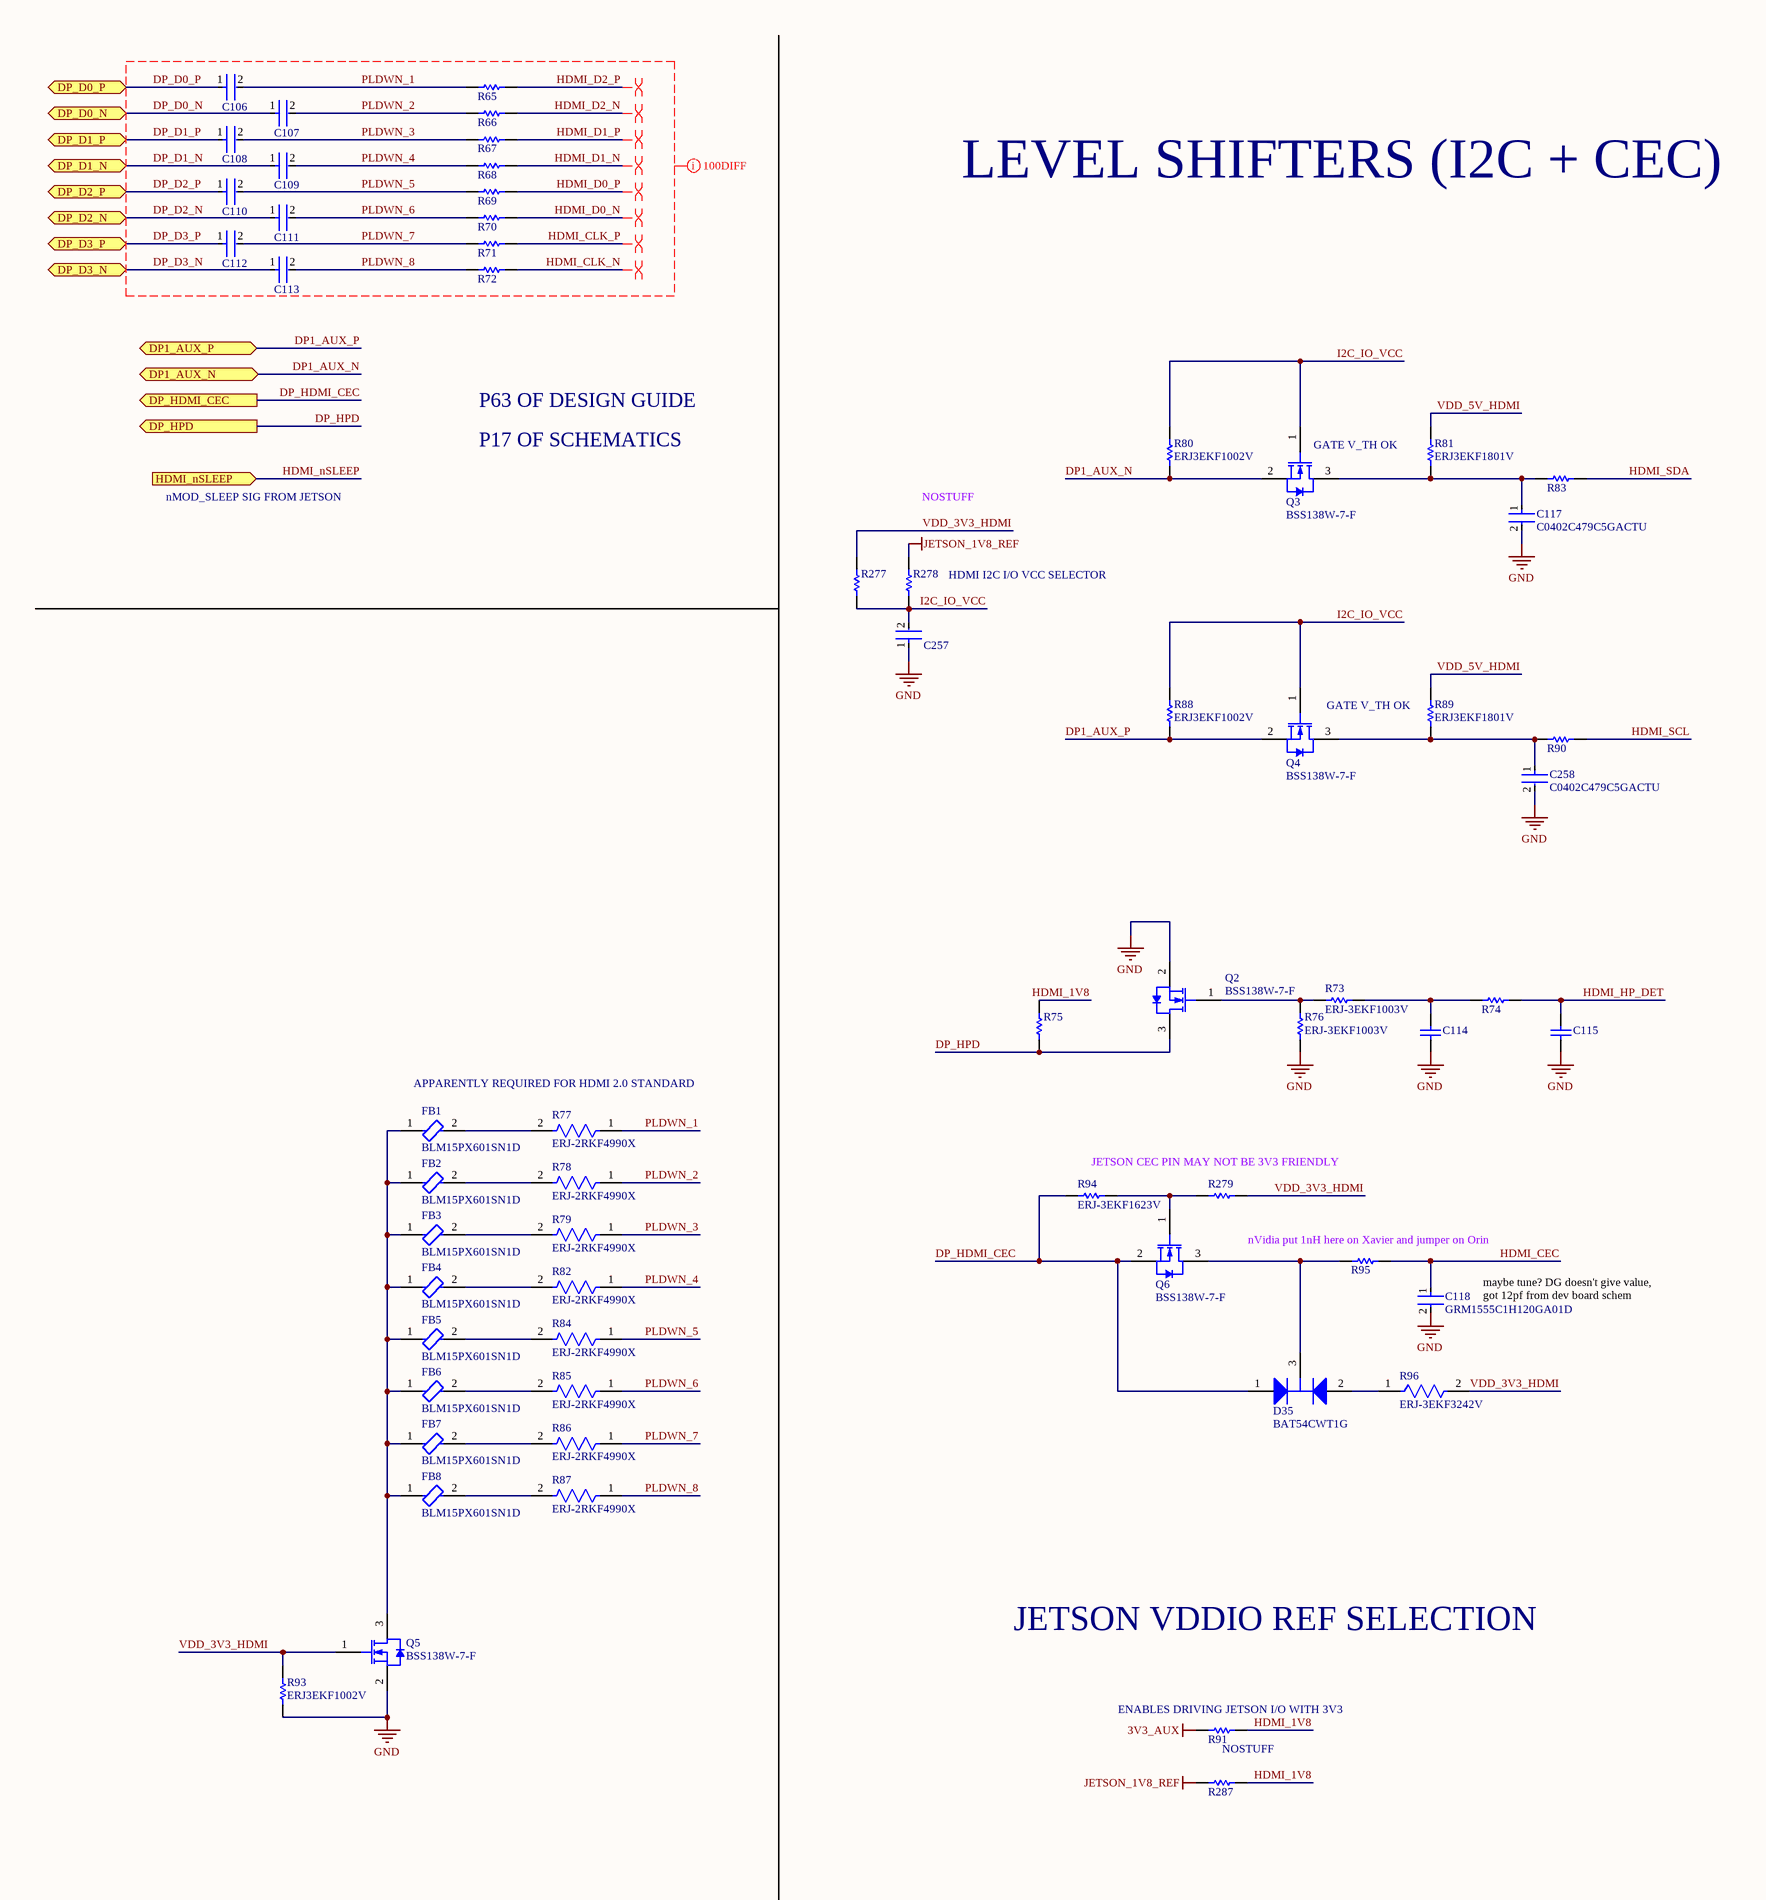
[diagram p6: HDMI.SchDoc, left]
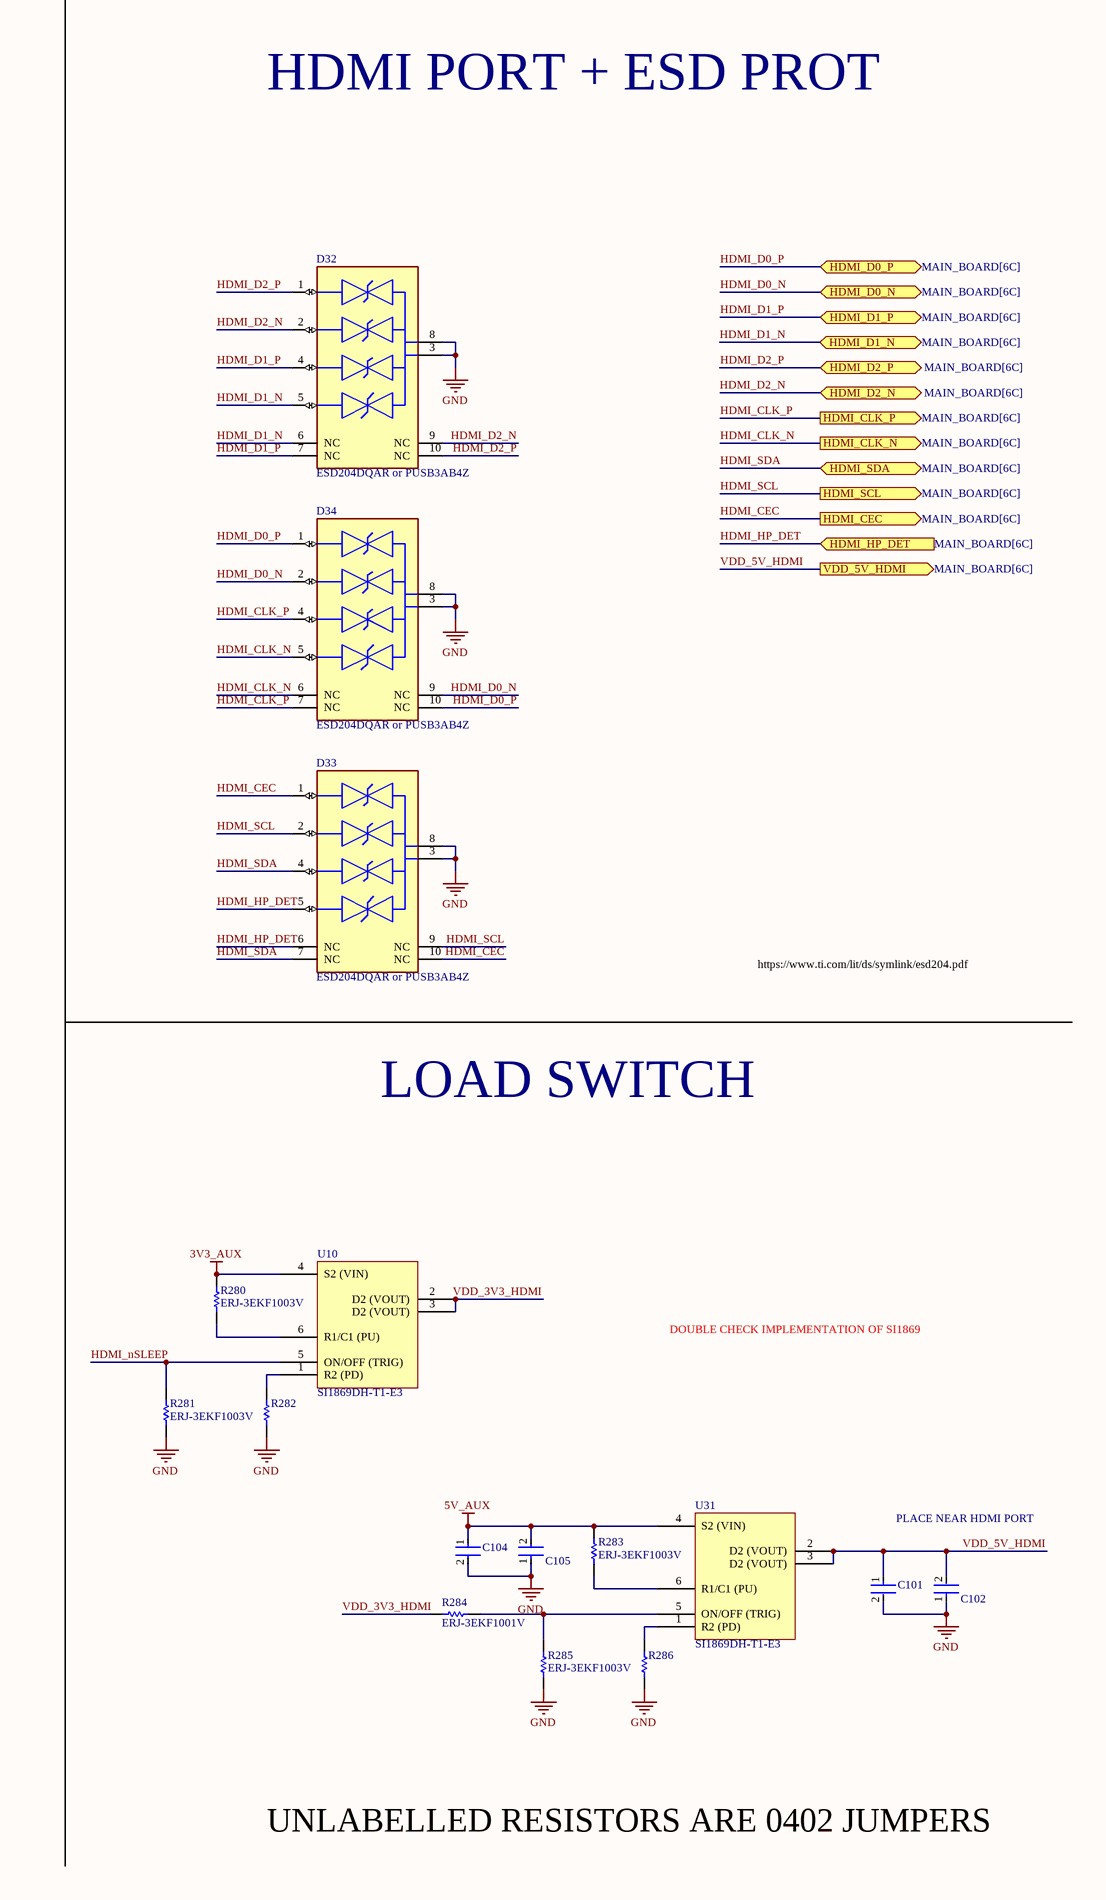
[diagram p7: HDMI.SchDoc, right]

### Parts
C101  GRM188R60J106ME47D  [FP-GRM188-0_1-e0_2_0_55-IPC_A]  (value not drawn)
C102  C1005X7R1H104K050BB  [FP-C1005-050-0_05-IPC_C]  (value not drawn)
C104  GRM188R60J106ME47D  [FP-GRM188-0_1-e0_2_0_55-IPC_A]  (value not drawn)
C105  C1005X7R1H104K050BB  [FP-C1005-050-0_05-IPC_C]  (value not drawn)
C106  C1005X7R1H104K050BB  [FP-C1005-050-0_05-IPC_C]  (value not drawn)
C107  C1005X7R1H104K050BB  [FP-C1005-050-0_05-IPC_C]  (value not drawn)
C108  C1005X7R1H104K050BB  [FP-C1005-050-0_05-IPC_C]  (value not drawn)
C109  C1005X7R1H104K050BB  [FP-C1005-050-0_05-IPC_C]  (value not drawn)
C110  C1005X7R1H104K050BB  [FP-C1005-050-0_05-IPC_C]  (value not drawn)
C111  C1005X7R1H104K050BB  [FP-C1005-050-0_05-IPC_C]  (value not drawn)
C112  C1005X7R1H104K050BB  [FP-C1005-050-0_05-IPC_C]  (value not drawn)
C113  C1005X7R1H104K050BB  [FP-C1005-050-0_05-IPC_C]  (value not drawn)
C114  C0402C221K5RAC7867  [CAPC1005X60X30NL05T10]  (value not drawn)
C115  C0402C221K5RAC7867  [CAPC1005X60X30NL05T10]  (value not drawn)
C117  C0402C479C5GACTU  [FP-C0402-BB-MFG]
C118  GRM1555C1H120GA01D  [FP-GRM155-0_05-MFG]
C257  C1005X7R1H104K050BB  [FP-C1005-050-0_05-IPC_C]  (value not drawn)
C258  C0402C479C5GACTU  [FP-C0402-BB-MFG]
D32  ESD204DQAR or PUSB3AB4Z  [FP-DQA0010A-MFG]
D33  ESD204DQAR or PUSB3AB4Z  [FP-DQA0010A-MFG]
D34  ESD204DQAR or PUSB3AB4Z  [FP-DQA0010A-MFG]
D35  BAT54CWT1G  [ONSC-SOT-323-3-419-04_V]
FB1  BLM15PX601SN1D  [FP-BLM15-0_05-MFG]
FB2  BLM15PX601SN1D  [FP-BLM15-0_05-MFG]
FB3  BLM15PX601SN1D  [FP-BLM15-0_05-MFG]
FB4  BLM15PX601SN1D  [FP-BLM15-0_05-MFG]
FB5  BLM15PX601SN1D  [FP-BLM15-0_05-MFG]
FB6  BLM15PX601SN1D  [FP-BLM15-0_05-MFG]
FB7  BLM15PX601SN1D  [FP-BLM15-0_05-MFG]
FB8  BLM15PX601SN1D  [FP-BLM15-0_05-MFG]
Q2  BSS138W-7-F  [DIOD-SOT323-3_V]
Q3  BSS138W-7-F  [DIOD-SOT323-3_V]
Q4  BSS138W-7-F  [DIOD-SOT323-3_V]
Q5  BSS138W-7-F  [DIOD-SOT323-3_V]
Q6  BSS138W-7-F  [DIOD-SOT323-3_V]
R65  0402 JUMPER  [RESC1005X40X25ML05T05]  (value not drawn)
R66  0402 JUMPER  [RESC1005X40X25ML05T05]  (value not drawn)
R67  0402 JUMPER  [RESC1005X40X25ML05T05]  (value not drawn)
R68  0402 JUMPER  [RESC1005X40X25ML05T05]  (value not drawn)
R69  0402 JUMPER  [RESC1005X40X25ML05T05]  (value not drawn)
R70  0402 JUMPER  [RESC1005X40X25ML05T05]  (value not drawn)
R71  0402 JUMPER  [RESC1005X40X25ML05T05]  (value not drawn)
R72  0402 JUMPER  [RESC1005X40X25ML05T05]  (value not drawn)
R73  ERJ-3EKF1003V  [RESC1608X55X30ML15T15]
R74  0402 JUMPER  [RESC1005X40X25ML05T05]  (value not drawn)
R75  ERJ3EKF1002V  [RESC1609X55X30LL15T15]  (value not drawn)
R76  ERJ-3EKF1003V  [RESC1608X55X30ML15T15]
R77  ERJ-2RKF4990X  [FP-ERJ2RK-MFG]
R78  ERJ-2RKF4990X  [FP-ERJ2RK-MFG]
R79  ERJ-2RKF4990X  [FP-ERJ2RK-MFG]
R80  ERJ3EKF1002V  [RESC1609X55X30LL15T15]
R81  ERJ3EKF1801V  [RESC1608X55X30LL15T15]
R82  ERJ-2RKF4990X  [FP-ERJ2RK-MFG]
R83  0402 JUMPER  [RESC1005X40X25ML05T05]  (value not drawn)
R84  ERJ-2RKF4990X  [FP-ERJ2RK-MFG]
R85  ERJ-2RKF4990X  [FP-ERJ2RK-MFG]
R86  ERJ-2RKF4990X  [FP-ERJ2RK-MFG]
R87  ERJ-2RKF4990X  [FP-ERJ2RK-MFG]
R88  ERJ3EKF1002V  [RESC1609X55X30LL15T15]
R89  ERJ3EKF1801V  [RESC1608X55X30LL15T15]
R90  0402 JUMPER  [RESC1005X40X25ML05T05]  (value not drawn)
R91  0402 JUMPER  [RESC1005X40X25ML05T05]  (value not drawn)
R93  ERJ3EKF1002V  [RESC1609X55X30LL15T15]
R94  ERJ-3EKF1623V  [RESC1608X55X30ML15T15]
R95  0402 JUMPER  [RESC1005X40X25ML05T05]  (value not drawn)
R96  ERJ-3EKF3242V  [FP-ERJ3EK-MFG]
R277  0402 JUMPER  [RESC1005X40X25ML05T05]  (value not drawn)
R278  0402 JUMPER  [RESC1005X40X25ML05T05]  (value not drawn)
R279  0402 JUMPER  [RESC1005X40X25ML05T05]  (value not drawn)
R280  ERJ-3EKF1003V  [RESC1608X55X30ML15T15]
R281  ERJ-3EKF1003V  [RESC1608X55X30ML15T15]
R282  0402 JUMPER  [RESC1005X40X25ML05T05]  (value not drawn)
R283  ERJ-3EKF1003V  [RESC1608X55X30ML15T15]
R284  ERJ-3EKF1001V  [RESC1608X55X30LL15T15]
R285  ERJ-3EKF1003V  [RESC1608X55X30ML15T15]
R286  0402 JUMPER  [RESC1005X40X25ML05T05]  (value not drawn)
R287  0402 JUMPER  [RESC1005X40X25ML05T05]  (value not drawn)
U10  SI1869DH-T1-E3  [SOT65P242X110-6N]
U31  SI1869DH-T1-E3  [SOT65P242X110-6N]

### Ports
DP1_AUX_N (bidir, see MAIN_BOARD[5C]), DP1_AUX_P (bidir, see MAIN_BOARD[5C]), DP_D0_N (bidir, see MAIN_BOARD[5C]), DP_D0_P (bidir, see MAIN_BOARD[5C]), DP_D1_N (bidir, see MAIN_BOARD[5C]), DP_D1_P (bidir, see MAIN_BOARD[5C]), DP_D2_N (bidir, see MAIN_BOARD[5C]), DP_D2_P (bidir, see MAIN_BOARD[5C]), DP_D3_N (bidir, see MAIN_BOARD[5C]), DP_D3_P (bidir, see MAIN_BOARD[5C]), DP_HDMI_CEC (out, see MAIN_BOARD[5C]), DP_HPD (out, see MAIN_BOARD[5C]), HDMI_CEC (out, see MAIN_BOARD[6C]), HDMI_CLK_N (out, see MAIN_BOARD[6C]), HDMI_CLK_P (out, see MAIN_BOARD[6C]), HDMI_D0_N (bidir, see MAIN_BOARD[6C]), HDMI_D0_P (bidir, see MAIN_BOARD[6C]), HDMI_D1_N (bidir, see MAIN_BOARD[6C]), HDMI_D1_P (bidir, see MAIN_BOARD[6C]), HDMI_D2_N (bidir, see MAIN_BOARD[6C]), HDMI_D2_P (bidir, see MAIN_BOARD[6C]), HDMI_HP_DET (in, see MAIN_BOARD[6C]), HDMI_nSLEEP (in, see MAIN_BOARD[5C]), HDMI_SCL (out, see MAIN_BOARD[6C]), HDMI_SDA (bidir, see MAIN_BOARD[6C]), VDD_5V_HDMI (out, see MAIN_BOARD[6C])

### Nets
3V3_AUX: R91.1 R280.2 U10.4(S2_(VIN))
5V_AUX: C104.1 C105.2 R283.2 U31.4(S2_(VIN))
GND: C101.2 C102.1 C104.2 C105.1 C114.1 C115.1 C117.2 C118.2 C257.1 C258.2 D32.3(GND) D32.8(GND) D33.3(GND) D33.8(GND) D34.3(GND) D34.8(GND) Q2.2(S) Q5.2(S) R76.1 R93.1 R281.1 R282.2 R285.1 R286.2
JETSON_1V8_REF: R278.2 R287.1
DP1_AUX_N: Q3.2(S) R80.1 ; port DP1_AUX_N
DP1_AUX_P: Q4.2(S) R88.1 ; port DP1_AUX_P
DP_D0_N: C107.1 ; port DP_D0_N
DP_D0_P: C106.1 ; port DP_D0_P
DP_D1_N: C109.1 ; port DP_D1_N
DP_D1_P: C108.1 ; port DP_D1_P
DP_D2_N: C111.1 ; port DP_D2_N
DP_D2_P: C110.1 ; port DP_D2_P
DP_D3_N: C113.1 ; port DP_D3_N
DP_D3_P: C112.1 ; port DP_D3_P
DP_HDMI_CEC: D35.1(A1) Q6.2(S) R94.1 ; port DP_HDMI_CEC
DP_HPD: Q2.3(D) R75.1 ; port DP_HPD
HDMI_1V8: R75.2 R91.2 R287.2
HDMI_CEC: C118.1 D33.1(IO1) D33.10(NC) R95.2 ; port HDMI_CEC
HDMI_CLK_N: D34.5(IO4) D34.6(NC) R72.2 ; port HDMI_CLK_N
HDMI_CLK_P: D34.4(IO3) D34.7(NC) R71.2 ; port HDMI_CLK_P
HDMI_D0_N: D34.2(IO2) D34.9(NC) R70.2 ; port HDMI_D0_N
HDMI_D0_P: D34.1(IO1) D34.10(NC) R69.2 ; port HDMI_D0_P
HDMI_D1_N: D32.5(IO4) D32.6(NC) R68.2 ; port HDMI_D1_N
HDMI_D1_P: D32.4(IO3) D32.7(NC) R67.2 ; port HDMI_D1_P
HDMI_D2_N: D32.2(IO2) D32.9(NC) R66.2
HDMI_D2_P: D32.1(IO1) D32.10(NC) R65.2 ; port HDMI_D2_P
HDMI_HP_DET: C115.2 D33.5(IO4) D33.6(NC) R74.2 ; port HDMI_HP_DET
HDMI_nSLEEP: R281.2 U10.5(ON/OFF_(TRIG)) ; port HDMI_nSLEEP
HDMI_SCL: D33.2(IO2) D33.9(NC) R90.2 ; port HDMI_SCL
HDMI_SDA: D33.4(IO3) D33.7(NC) R83.2 ; port HDMI_SDA
I2C_IO_VCC: C257.2 Q3.1(G) Q4.1(G) R80.2 R88.2 R277.1 R278.1
PLDWN_1: C106.2 R65.1 R77.1
PLDWN_2: C107.2 R66.1 R78.1
PLDWN_3: C108.2 R67.1 R79.1
PLDWN_4: C109.2 R68.1 R82.1
PLDWN_5: C110.2 R69.1 R84.1
PLDWN_6: C111.2 R70.1 R85.1
PLDWN_7: C112.2 R71.1 R86.1
PLDWN_8: C113.2 R72.1 R87.1
VDD_3V3_HDMI: Q5.1(G) R93.2 R96.2 R277.2 R279.1 R284.1 U10.2(D2_(VOUT)) U10.3(D2_(VOUT))
VDD_5V_HDMI: C101.1 C102.2 R81.2 R89.2 U31.2(D2_(VOUT)) U31.3(D2_(VOUT)) ; port VDD_5V_HDMI
NetC114_2: C114.2 R73.2 R74.1
NetC117_1: C117.1 Q3.3(D) R81.1 R83.1
NetC258_1: C258.1 Q4.3(D) R89.1 R90.1
NetD35_2: D35.2(A2) R96.1
NetD35_3: D35.3(K) Q6.3(D) R95.1
NetFB1_1: FB1.1 FB2.1 FB3.1 FB4.1 FB5.1 FB6.1 FB7.1 FB8.1 Q5.3(D)
NetFB1_2: FB1.2 R77.2
NetFB2_2: FB2.2 R78.2
NetFB3_2: FB3.2 R79.2
NetFB4_2: FB4.2 R82.2
NetFB5_2: FB5.2 R84.2
NetFB6_2: FB6.2 R85.2
NetFB7_2: FB7.2 R86.2
NetFB8_2: FB8.2 R87.2
NetQ2_1: Q2.1(G) R73.1 R76.2
NetQ6_1: Q6.1(G) R94.2 R279.2
NetR280_1: R280.1 U10.6(R1/C1_(PU))
NetR282_1: R282.1 U10.1(R2_(PD))
NetR283_1: R283.1 U31.6(R1/C1_(PU))
NetR284_2: R284.2 R285.2 U31.5(ON/OFF_(TRIG))
NetR286_1: R286.1 U31.1(R2_(PD))

### Layout directives
differential pair; differential pair class 100DIFF: HDMI_CLK_N, HDMI_CLK_P, HDMI_D0_N, HDMI_D0_P, HDMI_D1_N, HDMI_D1_P, HDMI_D2_N, HDMI_D2_P
net class 100DIFF: DP_D0_N, DP_D0_P, DP_D1_N, DP_D1_P, DP_D2_N, DP_D2_P, DP_D3_N, DP_D3_P, HDMI_CLK_N, HDMI_CLK_P, HDMI_D0_N, HDMI_D0_P, HDMI_D1_N, HDMI_D1_P, HDMI_D2_N, HDMI_D2_P, PLDWN_1, PLDWN_2, PLDWN_3, PLDWN_4, PLDWN_5, PLDWN_6, PLDWN_7, PLDWN_8

### Notes on the sheet
- HDMI PORT + ESD PROT
- LEVEL SHIFTERS (I2C + CEC)
- P63 OF DESIGN GUIDE
- nMOD_SLEEP SIG FROM JETSON
- P17 OF SCHEMATICS
- NOSTUFF
- (near Q3) GATE V_TH OK
- HDMI I2C I/O VCC SELECTOR
- (near Q4) GATE V_TH OK
- APPARENTLY REQUIRED FOR HDMI 2.0 STANDARD
- https://www.ti.com/lit/ds/symlink/esd204.pdf
- JETSON CEC PIN MAY NOT BE 3V3 FRIENDLY
- LOAD SWITCH
- (near R95) nVidia put 1nH here on Xavier and jumper on Orin
- maybe tune? DG doesn't give value, got 12pf from dev board schem
- DOUBLE CHECK IMPLEMENTATION OF SI1869
- JETSON VDDIO REF SELECTION
- PLACE NEAR HDMI PORT
- (near R91) ENABLES DRIVING JETSON I/O WITH 3V3
- (near R91) NOSTUFF
- UNLABELLED RESISTORS ARE 0402 JUMPERS
- Labels drawn without touching a wire or pin: HDMI_D2_N

### Library data of the parts
C101 C104 = CMP-2006-02792-2: as C?#31 on sheet NVME; Packaging: Tape and Reel; Voltage Rating (DC): 6.3V; Width: 0.031inch; Termination: SMD/SMT; Dielectric: X5R; Package Quantity: 4000; Voltage Rating: 6.3V; Capacitance: 10uF; Case/Package: 0603; Min Operating Temperature: -55°C; Voltage: 6.3V; Length: 1.6mm; Thickness: 0.035inch; Lead Free: Lead Free; Depth: 0.8mm; Case Code (Imperial): 0603; Max Operating Temperature: 85°C; Material: Ceramic; Height: 0.8mm; Tolerance: 20%; Mount: Surface Mount; REACH SVHC: No SVHC; Radiation Hardening: No; Case Code (Metric): 1608
C102 C105-C113 C257 = CMP-2000-05393-2: as C?#34 on sheet NVME; Voltage: 50V; Dielectric Material: Ceramic; Min Operating Temperature: -55°C; Depth: 0.5mm; Radiation Hardening: No; RoHS Compliant: Yes; Voltage Rating (DC): 50V; Lead Free: Lead Free; Resistor Type: Ceramic; Height: 0.5mm; Dielectric: X7R; Thickness: 0.022inch; Case/Package: 0402; Case Code (Metric): 1005; Termination: SMD/SMT; Capacitance: 100nF; Packaging: Tape and Reel; Max Operating Temperature: 125°C; Mount: Surface Mount; Package Quantity: 1; Width: 0.02inch; Weight: 2.3E-05oz; Voltage Rating: 50V; Tolerance: 10%; Construction: Flat; Case Code (Imperial): 0402; Length: 1mm; REACH SVHC: No SVHC; Series: C
C114 C115 = CMP-2008-03137-2: Manufacturer: Kemet; Part Number: C0402C221K5RAC7867
C117 C258 = CMP-2008-03310-2: CAP CER 4.7PF 50V NP0 0402; Manufacturer: Kemet; Material: Ceramic; Tolerance: 0.25 pF; Temperature Coefficient: 15%; Temperature Characteristic: C0G; Manufacturer Part Number: C0402C479C5GACTU; Lead Free: Yes; Device Class L1: Passive Components; ComponentLink2Description: Datasheet; Temperature: -55°C to +125°C; Digikey Description: CAP CER 4.7PF 50V NP0 0402; Ipc Land Pattern Name: CAPC10050X50; ComponentLink2URL: https://content.kemet.com/datasheets/KEM_C1002_X7R_SMD.pdf; Octopart: https://octopart.com/c0402c479c5gactu-kemet-9144199; Mouser Description: Multilayer Ceramic Capacitors MLCC - SMD/SMT 50volts 4.7pF C0G .25pF; Automotive: No; Voltage Rating: 50 V; Device Class L3: Ceramic Capacitors; Capacitance: 4.7 pF; Category: Cap; Value: 4.7 pF; Package: C0402-BB; Height: 0.55mm; Temperature Range Low: -55°C; RoHS: TRUE; Device Class L2: Capacitors; Temperature Range High: +125°C
C118 = CMP-2008-03945-2: CAP CER 12PF 50V C0G/NP0 0402; Tolerance: 2%; Dielectric: C0G; Material: Ceramic; Termination: SMD/SMT; Mount: Surface Mount; REACH SVHC: No SVHC; Depth: 0.5mm; Case Code (Metric): 1005; Voltage Rating: 50V; Height: 0.5mm; Voltage Rating (DC): 50V; Case Code (Imperial): 0402; Package Quantity: 10000; Construction: Flat; Thickness: 0.022inch; Length: 1mm; Min Operating Temperature: -55°C; Width: 0.5mm; Lead Free: Lead Free; Capacitance: 12pF; Case/Package: 0402; Packaging: Tape and Reel; Series: GRM; Voltage: 50V; Radiation Hardening: No; Max Operating Temperature: 125°C
D32-D34 = CMP-04989-000002-1: 4-CHANNEL LOW-CAPACITANCE SURGE; Manufacturer: Texas Instruments; Value: 0.55pF; Reverse Standoff Voltage: 3.6V; Standoff Height: 0mm; Breakdown Voltage: 5.5V; Peak Pulse Current: 5.5A; Clamping Voltage: 11.5V; Direction: Bidirectional; Peak Pulse Power: 50W; Number Of Channels: 4; Ambient Temperature Range High: +125°C; ComponentLink2Description: Datasheet; Height: 0.55mm; Lead Free: Yes; Device Class L3: unset; Temperature Range High: +125°C; Temperature Range Low: -40°C; Package: DQA0010A; Temperature: -40°C to +125°C; Capacitance: 0.55pF; RoHS: TRUE; Mouser Description: 4-Channel Low-Capacitance Surge and ESD Protection Diode 10-USON -40 to 125; Category: Diode; Device Class L1: Circuit Protection; Octopart: https://octopart.com/esd204dqar-texas+instruments-89917476; Device Class L2: TVS Diodes; Ambient Temperature Range Low: -40°C; Manufacturer Part Number: ESD204DQAR; ComponentLink2URL: http://www.ti.com/lit/ds/symlink/esd204.pdf; Automotive: No; Digikey Description: 4-CHANNEL LOW-CAPACITANCE SURGE
D35 = CMP-1055-00557-1: Dual Series Cathode Schottky Barrier Diodes, 3-Pin SOT-323, Pb-Free, Tape and Reel; Manufacturer: On Semiconductor; Configuration: Common Cathode; IFSM Max (A): 0.6; trr Max (ns): 5; ComponentLink2Description: Datasheet; Packing: Tape and Reel; ComponentLink3Description: Package Specification; Mounting Technology: Surface Mount; PartNumber: BAT54CWT1G; PackageVersion: Rev. N, 11/2008; RoHS: TRUE; ComponentLink3URL: http://www.onsemi.com/pub_link/Collateral/419-04.PDF; ComponentLink2URL: http://www.onsemi.cn/pub_link/Collateral/BAT54CWT1-D.PDF; PackageReference: SOT-323-3-419-04; ComponentLink1URL: http://www.onsemi.com/; ComponentLink1Description: Manufacturer URL; DatasheetVersion: Rev. 7; PackageDescription: 3-Pin Small Outline Transistor, Body 2 x 1.25 mm, Pitch 0.65 mm
FB1-FB8 = CMP-0686-00252-4: Chip Ferrite Bead, 0402, 600Ω @ 100MHz, 0.23Ω, 25%, 900mA; Number of Circuits: 1; Impedance: 600R; DC Resistance (DCR): 230mR; Material: Steel; Length: 1mm; Package Quantity: 10000; Height: 0.5mm; Width: 0.5mm; Max DC Current: 900mA; Number of Lines: 1; Termination: SMD/SMT; Packaging: Tape and Reel; Lead Free: Lead Free; Min Operating Temperature: -55°C; Max Operating Temperature: 125°C; Max Current Rating: 900mA; Case Code (Imperial): 0402; Number of Pins: 2; Current Rating: 900mA; Test Frequency: 100MHz; Case/Package: 0402; Tolerance: 25%; Case Code (Metric): 1005
Q2-Q6 = CMP-2000-05968-1: N-Channel Enhancement Mode Mosfet, 50 V, 200 mA, -55 to 150 degC, 6-Pin SOT-323, RoHS, Tape and Reel; Typical Turn-Off Delay Time: 20ns; Number of Channels: 1Channel; Type: EnhancementModeFieldEffectTransistor; Brand: DiodesIncorporated; Vds - Drain-Source Breakdown Voltage: 75V; Vgs - Gate-Source Voltage: 20V; Rds On - Drain-Source Resistance: 1.4Ohms; Transistor Type: 1N-Channel; Configuration: Single; Unit Weight: 0.000212oz; Pd - Power Dissipation: 200mW; Id - Continuous Drain Current: 200mA; Forward Transconductance - Min: 0.1S; Manufacturer URL: http://www.diodes.com/; Series: BSS138; Package Description: 3-Pin Small Outline Transistor, Body 2 x 1.25 mm, Pitch 0.65 mm; Mounting Technology: SurfaceMount; Product Category: MOSFET; RoHS: True; Maximum Operating Temperature: +150C; Height: 1mm; Length: 2.2mm; Technology: Si; Width: 1.35mm; Datasheet URL: http://www.diodes.com/_files/datasheets/ds30206.pdf; Manufacturer: DiodesIncorporated; Package / Case: SOT-323-3; Typical Turn-On Delay Time: 20ns; Transistor Polarity: N-Channel; Factory Pack Quantity: 3000; Packaging: Reel; Product: MOSFETSmallSignal; Datasheet Version: Rev. 11-2, 09/2013; Package Reference: SOT323; Minimum Operating Temperature: -55C; Mounting Style: SMD/SMT; Channel Mode: Enhancement
R65-R72 R74 R83 R90 R91 R95 R277-R279 R282 R286 R287 = CMP-009-00118-2: READ THE NAME; Pins: 2; Component Type: Standard; Design Item ID: CMP-009-00206-2; Source: 0402jump.SchLib
R73 R76 R280 R281 R283 R285 = CMP-2000-00182-1: Manufacturer: Panasonic; Part Number: ERJ-3EKF1003V
R75 R80 R88 R93 = CMP-1012-00623-3: as R?#10 on sheet NVME; Number of Pins: 2; Package Reference: 603; Depth: 0.8mm; Mount: SurfaceMount; Package Description: 2-Pin Surface Mount Device, Body 1.6 x 0.85 mm; Datasheet Version: 02/2017; Length: 1.6mm; Lead Free: LeadFree; Height: 0.45mm; Number of Terminations: 2; Max Power Dissipation: 100mW; Min Operating Temperature: -55degC; Datasheet URL: https://industrial.panasonic.com/cdbs/www-data/pdf/RDA0000/AOA0000C304.pdf; Termination: SMD/SMT; Case Code (Metric): 1608; Case Code (Imperial): 0603; Tolerance: 1%; Max Operating Temperature: 155degC; RoHSCompliant: true; Voltage Rating (DC): 75V; Radiation Hardening: No; Packaging: TapeandReel; Composition: ThickFilm; Mounting Technology: SurfaceMount; Manufacturer URL: http://www.panasonic.com/; Width: 0.031inch; REACH SVHC: NoSVHC; Contact Plating: Tin; Military Standard: Not; Package Quantity: 1
R77-R79 R82 R84-R87 = CMP-2002-00965-2: RES SMD 499 OHM 1% 1/10W 0402; Temperature Coefficient: 100ppm/°C; Max Power Dissipation: 100mW; Voltage Rating (DC): 50V; Resistance: 499R; Technology: THICK FILM; Min Operating Temperature: -55°C; Package Quantity: 1; Width: 0.02inch; Contact Plating: Tin; Tolerance: 1%; Features: Automotive AEC-Q200; Resistance Tolerance: 1%; Size Code: 0402; Military Standard: Not; Resistor Type: Thick Film; Case/Package: 0402; Mount: Surface Mount; Case Code (Metric): 1005; RoHS Compliant: Yes; REACH SVHC: No SVHC; Number of Terminations: 2; Construction: Rectangular; Packaging: Tape and Reel; Series: ERJ; Lead Free: Lead Free; Length: 1mm; Voltage Rating: 50V; Termination: SMD/SMT; Max Operating Temperature: 155°C; Case Code (Imperial): 0402; Height: 0.35mm; Power Rating: 100mW; Depth: 0.5mm
R81 R89 = CMP-2000-00389-1: MODIFIED P/N; Manufacturer: Panasonic; Part Number: ERJ3EKF2701V
R94 = CMP-1012-00758-2: Manufacturer: Panasonic; Part Number: ERJ-3EKF1623V
R96 = CMP-2000-00433-2: RES SMD 32.4K OHM 1% 1/10W 0603; Voltage Rating: 75V; Max Power Dissipation: 100mW; Temperature Coefficient: 100ppm/°C; Resistance: 32.4kR; Voltage Rating (DC): 50V; Technology: THICK FILM; Tolerance: 1%; Features: Automotive AEC-Q200; Width: 0.8mm; Case/Package: 0603; Min Operating Temperature: -55°C; Power Rating: 100mW; Contact Plating: Tin; Case Code (Imperial): 0603; Number of Terminations: 2; Lead Free: Lead Free; Length: 1.6mm; Series: ERJ; Packaging: Tape and Reel; RoHS Compliant: Yes; Military Standard: Not; Termination: SMD/SMT; Case Code (Metric): 1608; Max Operating Temperature: 155°C; Package Quantity: 1; Mount: Surface Mount; Resistor Type: Thick Film; Construction: Rectangular; Height: 0.45mm; Resistance Tolerance: 1%; Depth: 0.8mm; Radiation Hardening: No
R284 = CMP-2000-00180-1: Manufacturer: Panasonic; Part Number: ERJ-3EKF1001V
U10 U31 = CMP-019-00043-2: Power Supply Support Circuit, Adjustable, 1 Channel, PDSO6; Max Supply Voltage: 20V; Min Supply Voltage: 1.8V; Case/Package: TSSOP; Pins: 6; RoHS Compliant: Yes

## Sheet RECOVERY_USBC.SchDoc
size A4; SheetNumber: 10; SheetTotal: 10
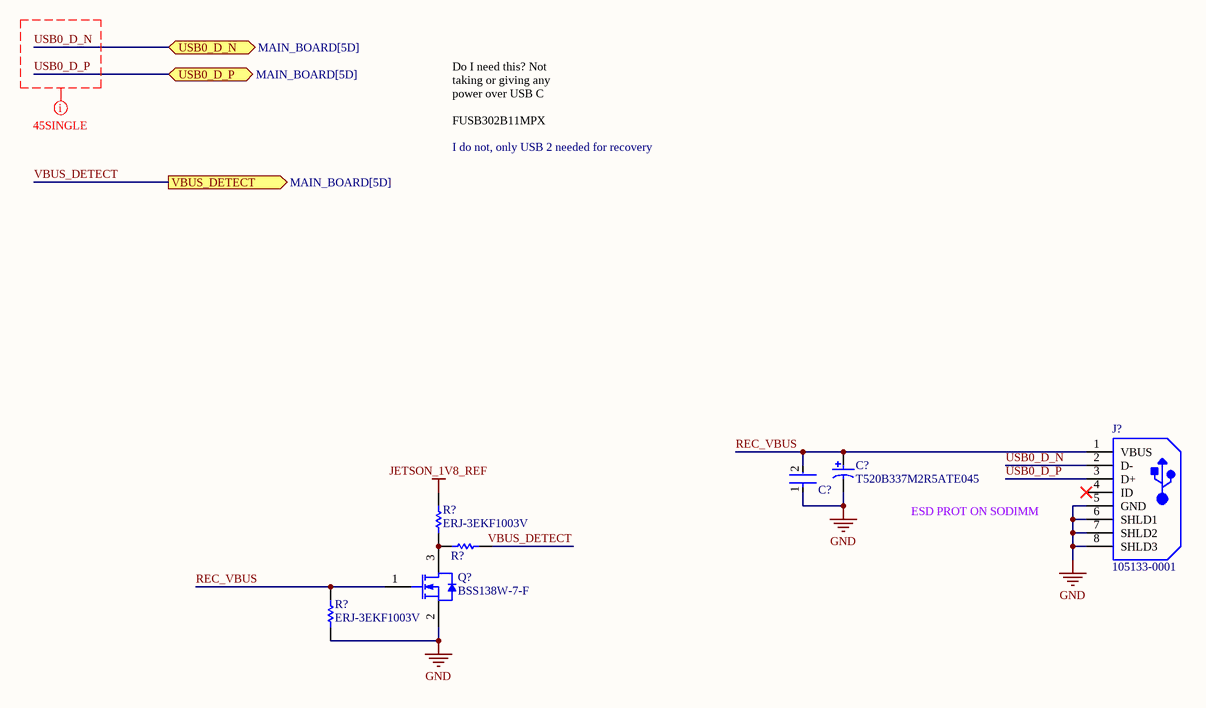
[diagram p8: RECOVERY_USBC.SchDoc]

### Parts
(Parts that share a designator on the sheet are numbered #1, #2 ... from top to bottom, then left to right.)
C?#41  T520B337M2R5ATE045  [KEMT-520-B-2_M]
C?#42  C1005X7R1H104K050BB  [FP-C1005-050-0_05-IPC_C]  (value not drawn)
J?#8  105133-0001  [MOLX-105133-0001_V]
Q?  BSS138W-7-F  [DIOD-SOT323-3_V]
R?#20  ERJ-3EKF1003V  [RESC1608X55X30ML15T15]
R?#21  0402 JUMPER  [RESC1005X40X25ML05T05]  (value not drawn)
R?#22  ERJ-3EKF1003V  [RESC1608X55X30ML15T15]

### Ports
USB0_D_N (bidir, see MAIN_BOARD[5D]), USB0_D_P (bidir, see MAIN_BOARD[5D]), VBUS_DETECT (out, see MAIN_BOARD[5D])

### Nets
GND: C?#41.2 C?#42.1 J?#8.5(GND) J?#8.6(SHLD1) J?#8.7(SHLD2) J?#8.8(SHLD3) Q?.2(S) R?#22.1
JETSON_1V8_REF: R?#20.2
REC_VBUS: C?#41.1 C?#42.2 J?#8.1(VBUS) Q?.1(G) R?#22.2
USB0_D_N: J?#8.2(D-) ; port USB0_D_N
USB0_D_P: J?#8.3(D+) ; port USB0_D_P
VBUS_DETECT: R?#21.2 ; port VBUS_DETECT
NetQ?_3: Q?.3(D) R?#20.1 R?#21.1

Not connected (* = marked no-connect by the designer): J?#8 4(ID)*

### Layout directives
net class 45SINGLE: USB0_D_N, USB0_D_P

### Notes on the sheet
- Do I need this? Not taking or giving any power over USB C
  FUSB302B11MPX
- I do not, only USB 2 needed for recovery
- ESD PROT ON SODIMM

### Library data of the parts
C?#41 = CMP-1664-00002-2: Tantalum Capacitor, 330 uF, +/- 20%, 2.5 V, -55 to 105 degC, 2-Pin Molded, RoHS, Tape and Reel; Capacitance: 330 uF; PartNumber: T520B337M2R5ATE045; DatasheetVersion: 07/2016; Radiation Hardening: No; ComponentLink2Description: Datasheet; PackageDescription: 2-Pin Surface Mount Device, Body 3.5 x 2.8 mm; Width: 2.8 mm; ComponentLink2URL: http://capacitoredge.kemet.com/capedge2/DataSheet?pn=T520B337M2R5ATE045; Case/Package: 1411; Length: 3.5 mm; Package Quantity: 2000; Max Operating Temperature: 105 degC; Mounting Technology: Surface Mount; Height: 2.1 mm; RoHSCompliant: True; ComponentLink1URL: http://www.kemet.com/; Mount: Surface Mount; Packaging: Tape and Reel; ComponentLink1Description: Manufacturer URL; Min Operating Temperature: -55 degC
C?#42 = CMP-2000-05393-2: as C?#34 on sheet NVME; Voltage: 50V; Dielectric Material: Ceramic; Min Operating Temperature: -55°C; Depth: 0.5mm; Radiation Hardening: No; RoHS Compliant: Yes; Voltage Rating (DC): 50V; Lead Free: Lead Free; Resistor Type: Ceramic; Height: 0.5mm; Dielectric: X7R; Thickness: 0.022inch; Case/Package: 0402; Case Code (Metric): 1005; Termination: SMD/SMT; Capacitance: 100nF; Packaging: Tape and Reel; Max Operating Temperature: 125°C; Mount: Surface Mount; Package Quantity: 1; Width: 0.02inch; Weight: 2.3E-05oz; Voltage Rating: 50V; Tolerance: 10%; Construction: Flat; Case Code (Imperial): 0402; Length: 1mm; REACH SVHC: No SVHC; Series: C
J?#8 = CMP-2000-05829-1: Micro-USB B Receptacle, Vertical, -30 to 85 degC, 5-Pin SMD, RoHS, Tape and Reel; Manufacturer: Molex; Package Version: Rev. C, 11/2015; Voltage Rating: 30VAC; Connector Type: MicroUSBTypeBReceptacle; Current Rating: 1.8A; Number of Ports: 1; Voltage - Max: 30V; Mounting Style: SMD/SMT; Packaging: Reel; Product: MicroUSBTypeBConnectors; Contact Plating: Gold; Flammability Rating: UL94V-0; Package Description: 5-Pin Surface Mount Device, Pitch 0.65 mm; Package Reference: 105133-0001; Contact Material: CopperAlloy; Mounting Angle: Vertical; RoHS: Details; Manufacturer URL: http://www.molex.com/; Factory Pack Quantity: 6000; PartNumber: 105133-0001; Standard: USB; Brand: Molex; Series: 105133; Product Category: USBConnectors; Termination Style: SolderTail; Gender: Receptacle; Package URL: http://www.molex.com/pdm_docs/sd/1051330001_sd.pdf; Datasheet Version: 03/2016; Color: Black; Datasheet URL: http://www.molex.com/webdocs/datasheets/pdf/en-us/1051330001_IO_CONNECTORS.pdf; Mounting Technology: SurfaceMount
Q? = CMP-2000-05968-1: as Q2 on sheet HDMI; Manufacturer URL: http://www.diodes.com/; Series: BSS138; Package Description: 3-Pin Small Outline Transistor, Body 2 x 1.25 mm, Pitch 0.65 mm; Mounting Technology: SurfaceMount; Product Category: MOSFET; RoHS: True; Maximum Operating Temperature: +150C; Height: 1mm; Length: 2.2mm; Technology: Si; Width: 1.35mm; Datasheet URL: http://www.diodes.com/_files/datasheets/ds30206.pdf; Manufacturer: DiodesIncorporated; Package / Case: SOT-323-3; Typical Turn-On Delay Time: 20ns; Transistor Polarity: N-Channel; Factory Pack Quantity: 3000; Packaging: Reel; Product: MOSFETSmallSignal; Datasheet Version: Rev. 11-2, 09/2013; Package Reference: SOT323; Minimum Operating Temperature: -55C; Mounting Style: SMD/SMT; Channel Mode: Enhancement
R?#20 R?#22 = CMP-2000-00182-1: Manufacturer: Panasonic; Part Number: ERJ-3EKF1003V
R?#21 = CMP-009-00118-2: READ THE NAME; Pins: 2; Component Type: Standard; Design Item ID: CMP-009-00206-2; Source: 0402jump.SchLib